# Altium project CT8042.PrjPcb (part 2 of 2)

## Sheet IBVG-DRIVER.SchDoc
size Tabloid; SheetNumber: 5; SheetTotal: 10
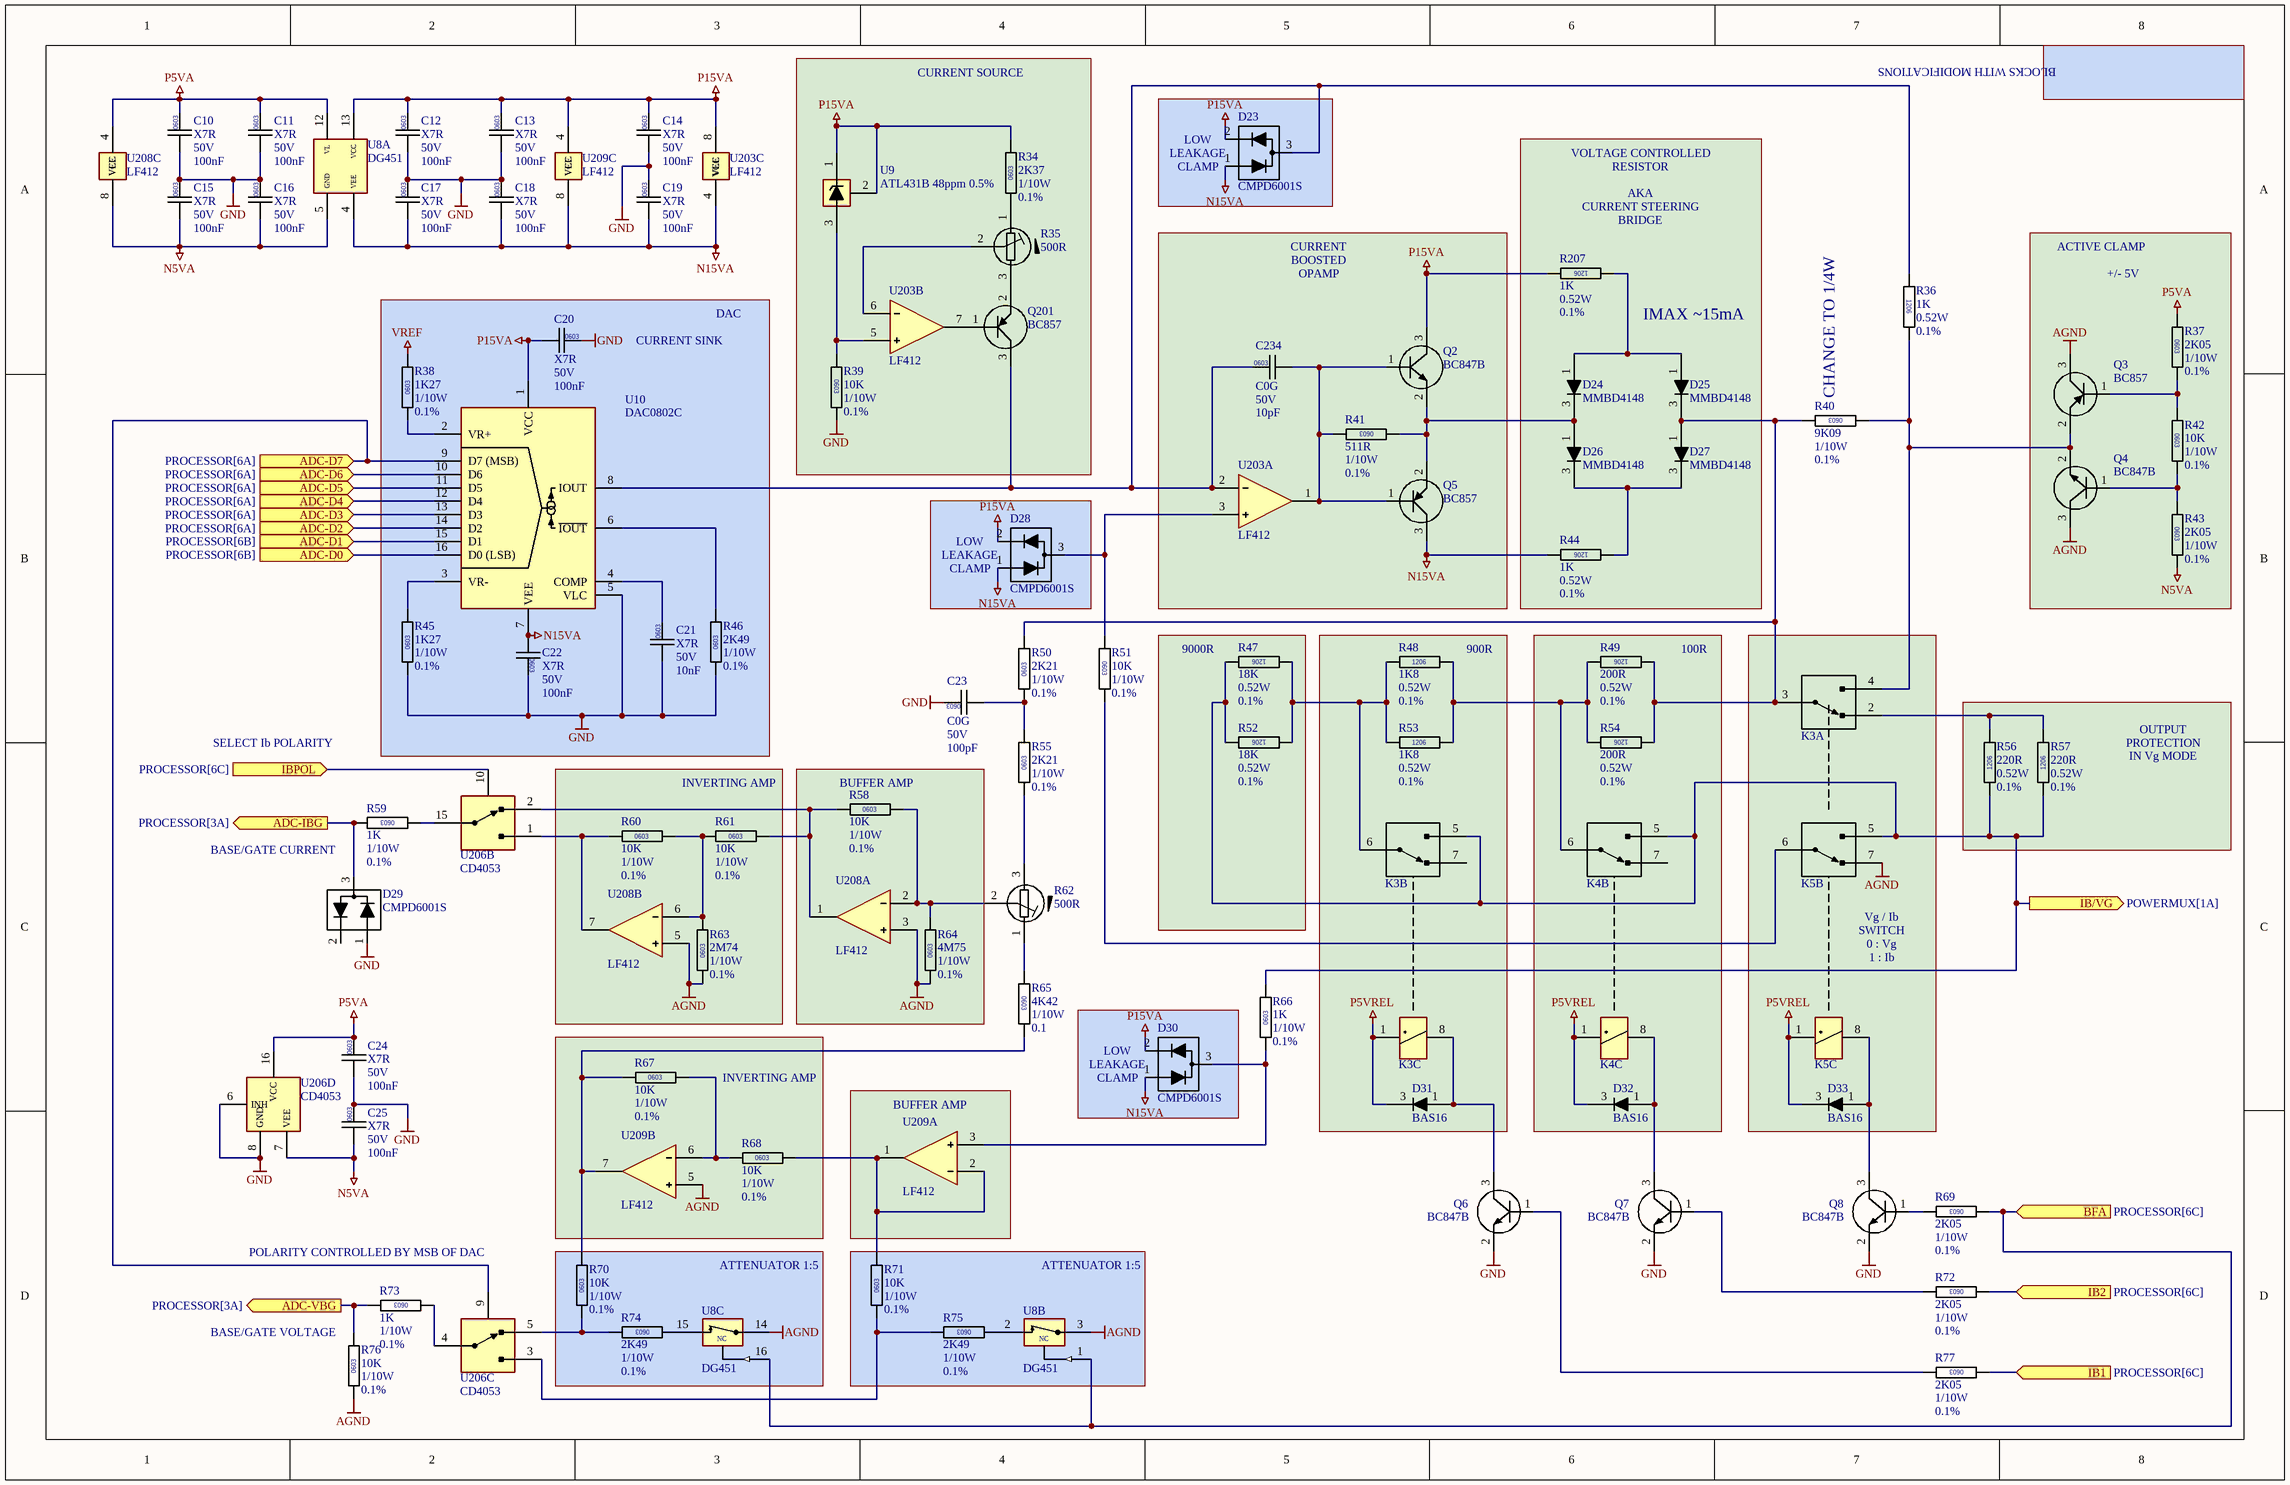
[diagram p6: IBVG-DRIVER.SchDoc]

### Parts
C10  Dielectric: X7R  Voltage: 50V  Capacitance: 100nF  [CAPC0603]  (hidden comment: CAP0603)
C11  Dielectric: X7R  Voltage: 50V  Capacitance: 100nF  [CAPC0603]  (hidden comment: CAP0603)
C12  Dielectric: X7R  Voltage: 50V  Capacitance: 100nF  [CAPC0603]  (hidden comment: CAP0603)
C13  Dielectric: X7R  Voltage: 50V  Capacitance: 100nF  [CAPC0603]  (hidden comment: CAP0603)
C14  Dielectric: X7R  Voltage: 50V  Capacitance: 100nF  [CAPC0603]  (hidden comment: CAP0603)
C15  Dielectric: X7R  Voltage: 50V  Capacitance: 100nF  [CAPC0603]  (hidden comment: CAP0603)
C16  Dielectric: X7R  Voltage: 50V  Capacitance: 100nF  [CAPC0603]  (hidden comment: CAP0603)
C17  Dielectric: X7R  Voltage: 50V  Capacitance: 100nF  [CAPC0603]  (hidden comment: CAP0603)
C18  Dielectric: X7R  Voltage: 50V  Capacitance: 100nF  [CAPC0603]  (hidden comment: CAP0603)
C19  Dielectric: X7R  Voltage: 50V  Capacitance: 100nF  [CAPC0603]  (hidden comment: CAP0603)
C20  Dielectric: X7R  Voltage: 50V  Capacitance: 100nF  [CAPC0603]  (hidden comment: CAP0603)
C21  Dielectric: X7R  Voltage: 50V  Capacitance: 10nF  [CAPC0603]  (hidden comment: CAP0603)
C22  Dielectric: X7R  Voltage: 50V  Capacitance: 100nF  [CAPC0603]  (hidden comment: CAP0603)
C23  Dielectric: C0G  Voltage: 50V  Capacitance: 100pF  [CAPC0603]  (hidden comment: CAP0603)
C24  Dielectric: X7R  Voltage: 50V  Capacitance: 100nF  [CAPC0603]  (hidden comment: CAP0603)
C25  Dielectric: X7R  Voltage: 50V  Capacitance: 100nF  [CAPC0603]  (hidden comment: CAP0603)
C234  Dielectric: C0G  Voltage: 50V  Capacitance: 10pF  [CAPC0603]  (hidden comment: CAP0603)
D23  CMPD6001S  [SOT23]
D24  MMBD4148
D25  MMBD4148
D26  MMBD4148
D27  MMBD4148
D28  CMPD6001S  [SOT23]
D29  CMPD6001S  [SOT23]
D30  CMPD6001S  [SOT23]
D31  BAS16  [SOT23]
D32  BAS16  [SOT23]
D33  BAS16  [SOT23]
K3  RELAY-KEMET-UA2-5NJ  [RELAY-KEMET-UA2-5NJ]  (value not drawn)  (parts A,B,C of 3)
K4  RELAY-KEMET-UA2-5NJ  [RELAY-KEMET-UA2-5NJ]  (value not drawn)  (parts B,C of 3)
K5  RELAY-KEMET-UA2-5NJ  [RELAY-KEMET-UA2-5NJ]  (value not drawn)  (parts B,C of 3)
Q2  BC847B  [SOT23]
Q3  BC857  [SOT23]
Q4  BC847B  [SOT23]
Q5  BC857  [SOT23]
Q6  BC847B  [SOT23]
Q7  BC847B  [SOT23]
Q8  BC847B  [SOT23]
Q201  BC857  [SOT23]
R34  value 2K37  Power: 1/10W  Tolerance: 0.1%  [RESC0603]  (hidden comment: RESC0603)
R35  value 500R  [TRIMMER-BOURNS-3214X]  (hidden comment: TRIMMER-BOURNS-3214X-1-501)
R36  value 1K  Power: 0.52W  Tolerance: 0.1%  [RESC1206]  (hidden comment: RESC1206)
R37  value 2K05  Power: 1/10W  Tolerance: 0.1%  [RESC0603]  (hidden comment: RESC0603)
R38  value 1K27  Power: 1/10W  Tolerance: 0.1%  [RESC0603]  (hidden comment: RESC0603)
R39  value 10K  Power: 1/10W  Tolerance: 0.1%  [RESC0603]  (hidden comment: RESC0603)
R40  value 9K09  Power: 1/10W  Tolerance: 0.1%  [RESC0603]  (hidden comment: RESC0603)
R41  value 511R  Power: 1/10W  Tolerance: 0.1%  [RESC0603]  (hidden comment: RESC0603)
R42  value 10K  Power: 1/10W  Tolerance: 0.1%  [RESC0603]  (hidden comment: RESC0603)
R43  value 2K05  Power: 1/10W  Tolerance: 0.1%  [RESC0603]  (hidden comment: RESC0603)
R44  value 1K  Power: 0.52W  Tolerance: 0.1%  [RESC1206]  (hidden comment: RESC1206)
R45  value 1K27  Power: 1/10W  Tolerance: 0.1%  [RESC0603]  (hidden comment: RESC0603)
R46  value 2K49  Power: 1/10W  Tolerance: 0.1%  [RESC0603]  (hidden comment: RESC0603)
R47  value 18K  Power: 0.52W  Tolerance: 0.1%  [RESC1206]  (hidden comment: RESC1206)
R48  value 1K8  Power: 0.52W  Tolerance: 0.1%  [RESC1206]  (hidden comment: RESC1206)
R49  value 200R  Power: 0.52W  Tolerance: 0.1%  [RESC1206]  (hidden comment: RESC1206)
R50  value 2K21  Power: 1/10W  Tolerance: 0.1%  [RESC0603]  (hidden comment: RESC0603)
R51  value 10K  Power: 1/10W  Tolerance: 0.1%  [RESC0603]  (hidden comment: RESC0603)
R52  value 18K  Power: 0.52W  Tolerance: 0.1%  [RESC1206]  (hidden comment: RESC1206)
R53  value 1K8  Power: 0.52W  Tolerance: 0.1%  [RESC1206]  (hidden comment: RESC1206)
R54  value 200R  Power: 0.52W  Tolerance: 0.1%  [RESC1206]  (hidden comment: RESC1206)
R55  value 2K21  Power: 1/10W  Tolerance: 0.1%  [RESC0603]  (hidden comment: RESC0603)
R56  value 220R  Power: 0.52W  Tolerance: 0.1%  [RESC1206]  (hidden comment: RESC1206)
R57  value 220R  Power: 0.52W  Tolerance: 0.1%  [RESC1206]  (hidden comment: RESC1206)
R58  value 10K  Power: 1/10W  Tolerance: 0.1%  [RESC0603]  (hidden comment: RESC0603)
R59  value 1K  Power: 1/10W  Tolerance: 0.1%  [RESC0603]  (hidden comment: RESC0603)
R60  value 10K  Power: 1/10W  Tolerance: 0.1%  [RESC0603]  (hidden comment: RESC0603)
R61  value 10K  Power: 1/10W  Tolerance: 0.1%  [RESC0603]  (hidden comment: RESC0603)
R62  value 500R  [TRIMMER-BOURNS-3214X]  (hidden comment: TRIMMER-BOURNS-3214X-1-501)
R63  value 2M74  Power: 1/10W  Tolerance: 0.1%  [RESC0603]  (hidden comment: RESC0603)
R64  value 4M75  Power: 1/10W  Tolerance: 0.1%  [RESC0603]  (hidden comment: RESC0603)
R65  value 4K42  Power: 1/10W  Tolerance: 0.1  [RESC0603]  (hidden comment: RESC0603)
R66  value 1K  Power: 1/10W  Tolerance: 0.1%  [RESC0603]  (hidden comment: RESC0603)
R67  value 10K  Power: 1/10W  Tolerance: 0.1%  [RESC0603]  (hidden comment: RESC0603)
R68  value 10K  Power: 1/10W  Tolerance: 0.1%  [RESC0603]  (hidden comment: RESC0603)
R69  value 2K05  Power: 1/10W  Tolerance: 0.1%  [RESC0603]  (hidden comment: RESC0603)
R70  value 10K  Power: 1/10W  Tolerance: 0.1%  [RESC0603]  (hidden comment: RESC0603)
R71  value 10K  Power: 1/10W  Tolerance: 0.1%  [RESC0603]  (hidden comment: RESC0603)
R72  value 2K05  Power: 1/10W  Tolerance: 0.1%  [RESC0603]  (hidden comment: RESC0603)
R73  value 1K  Power: 1/10W  Tolerance: 0.1%  [RESC0603]  (hidden comment: RESC0603)
R74  value 2K49  Power: 1/10W  Tolerance: 0.1%  [RESC0603]  (hidden comment: RESC0603)
R75  value 2K49  Power: 1/10W  Tolerance: 0.1%  [RESC0603]  (hidden comment: RESC0603)
R76  value 10K  Power: 1/10W  Tolerance: 0.1%  [RESC0603]  (hidden comment: RESC0603)
R77  value 2K05  Power: 1/10W  Tolerance: 0.1%  [RESC0603]  (hidden comment: RESC0603)
R207  value 1K  Power: 0.52W  Tolerance: 0.1%  [RESC1206]  (hidden comment: RESC1206)
U8  DG451  [SO127P600-16N]  (parts A,B,C of 5)
U9  ATL431B 48ppm 0.5%  [SOT23]
U10  DAC0802C
U203  LF412  [SO127P600-8N]  (parts A,B,C of 3)
U206  CD4053  [SO127P600-16N]  (parts B,C,D of 4)
U208  LF412  [SO127P600-8N]  (parts A,B,C of 3)
U209  LF412  [SO127P600-8N]  (parts A,B,C of 3)

### Blocks framed on the sheet
CURRENT SOURCE: Q201 R34 R35 R39 U9 U203
IMAX ~15mA: D24-D27 R44 R207
9000R: R47 R52
900R: D31 K3 R48 R53
100R: D32 K4 R49 R54
INVERTING AMP: R60 R61 R63 U208
BUFFER AMP: R58 R64 U208
INVERTING AMP: R67 R68 U209
BUFFER AMP: U209
ATTENUATOR 1:5: R70 R74 U8
ATTENUATOR 1:5: R71 R75 U8

### Ports
ADC-D0 (in, see PROCESSOR[6B]), ADC-D1 (in, see PROCESSOR[6B]), ADC-D2 (in, see PROCESSOR[6A]), ADC-D3 (in, see PROCESSOR[6A]), ADC-D4 (in, see PROCESSOR[6A]), ADC-D5 (in, see PROCESSOR[6A]), ADC-D6 (in, see PROCESSOR[6A]), ADC-D7 (in, see PROCESSOR[6A]), ADC-IBG (out, see PROCESSOR[3A]), ADC-VBG (out, see PROCESSOR[3A]), BFA (in, see PROCESSOR[6C]), IB1 (in, see PROCESSOR[6C]), IB2 (in, see PROCESSOR[6C]), IB/VG (out, see POWERMUX[1A]), IBPOL (in, see PROCESSOR[6C])

### Nets
AGND: K5.7(NC) Q3.3(C) Q4.3(C) R63.2 R64.2 R76.2 U8.3 U8.14 U208.3(+) U208.5(+) U209.5(+)
GND: C10.2 C11.2 C12.2 C13.2 C14.2 C15.1 C16.1 C17.1 C18.1 C19.1 C20.1 C21.2 C22.1 C23.1 C24.2 C25.1 D29.1(K) Q6.2(E) Q7.2(E) Q8.2(E) R39.1 R45.2 R46.2 U10.5(VLC) U206.6(INH) U206.8(GND)
N5VA: C15.2 C16.2 C25.2 R43.2 U8.5(GND) U206.7(VEE) U208.8(VCC)
N15VA: C17.2 C18.2 C19.2 C22.2 D23.1(K) D28.1(K) D30.1(K) Q5.3(C) R44.1 U8.4(VEE) U10.7(VEE) U203.4(VEE) U209.8(VCC)
P5VA: C10.1 C11.1 C24.1 R37.1 U8.12(VL) U206.16(VCC) U208.4(VEE)
P5VREL: D31.3(K) D32.3(K) D33.3(K) K3.1 K4.1 K5.1
P15VA: C12.1 C13.1 C14.1 C20.2 D23.2(A) D28.2(A) D30.2(A) Q2.3(C) R34.1 R207.1 U8.13(VCC) U9.1 U9.2 U10.1(VCC) U203.8(VCC) U209.4(VEE)
VREF: R38.1
ADC-D0: U10.16(D0_(LSB)) ; port ADC-D0
ADC-D1: U10.15(D1) ; port ADC-D1
ADC-D2: U10.14(D2) ; port ADC-D2
ADC-D3: U10.13(D3) ; port ADC-D3
ADC-D4: U10.12(D4) ; port ADC-D4
ADC-D5: U10.11(D5) ; port ADC-D5
ADC-D6: U10.10(D6) ; port ADC-D6
ADC-D7: U10.9(D7_(MSB)) U206.9(B) ; port ADC-D7
ADC-IBG: D29.3(A) R59.1 ; port ADC-IBG
ADC-VBG: R73.1 R76.1 ; port ADC-VBG
BFA: R69.1 U8.1 U8.16 ; port BFA
IB1: R77.1 ; port IB1
IB2: R72.1 ; port IB2
IB/VG: K3.5(NO) K4.5(NO) K5.5(NO) R47.2 R52.2 R56.2 R57.2 R66.1 ; port IB/VG
IBPOL: U206.10(A) ; port IBPOL
NetC21_1: C21.1 U10.4(COMP)
NetC23_2: C23.2 R50.2 R55.1
NetC234_1: C234.1 D23.3(A) Q201.3(C) R36.2 U10.8(IOUT) U203.2(-)
NetC234_2: C234.2 Q2.1(B) Q5.1(B) R41.1 U203.1(O)
NetD24_1: D24.1(A) D25.1(A) R207.2
NetD24_3: D24.3(K) D26.1(A) Q2.2(E) Q5.2(E) R41.2
NetD25_3: D25.3(K) D27.1(A) K3.3(COM) R40.1 R49.1 R50.1 R54.1
NetD26_3: D26.3(K) D27.3(K) R44.2
NetD28_3: D28.3(A) R51.2 U203.3(+)
NetD30_3: D30.3(A) R66.2 U209.3(+)
NetD31_1: D31.1(A) K3.8 Q6.3(C)
NetD32_1: D32.1(A) K4.8 Q7.3(C)
NetD33_1: D33.1(A) K5.8 Q8.3(C)
NetK3_2: K3.2(NC) R56.1 R57.1
NetK3_4: K3.4(NO) Q3.2(E) Q4.2(E) R36.1 R40.2
NetK3_6: K3.6(COM) R47.1 R48.1 R52.1 R53.1
NetK4_6: K4.6(COM) R48.2 R49.2 R53.2 R54.2
NetK5_6: K5.6(COM) R51.1
NetQ3_1: Q3.1(B) R37.2 R42.2
NetQ4_1: Q4.1(B) R42.1 R43.1
NetQ6_1: Q6.1(B) R77.2
NetQ7_1: Q7.1(B) R72.2
NetQ8_1: Q8.1(B) R69.2
NetQ201_1: Q201.1(B) U203.7(O)
NetQ201_2: Q201.2(E) R35.3
NetR34_2: R34.2 R35.1
NetR35_2: R35.2 U203.6(-)
NetR38_2: R38.2 U10.2(VR+)
NetR39_2: R39.2 U9.3 U203.5(+)
NetR45_1: R45.1 U10.3(VR-)
NetR46_1: R46.1 U10.6(~{IOUT})
NetR55_2: R55.2 R62.3
NetR58_1: R58.1 R62.2 R64.1 U208.2(-)
NetR58_2: R58.2 R61.1 U206.2(Y2) U208.1(O)
NetR59_2: R59.2 U206.15(X2)
NetR60_1: R60.1 R61.2 R63.1 U208.6(-)
NetR60_2: R60.2 U206.1(Y0) U208.7(O)
NetR62_1: R62.1 R65.2
NetR65_1: R65.1 R67.2 R70.1 U209.7(O)
NetR67_1: R67.1 R68.2 U209.6(-)
NetR68_1: R68.1 R71.1 U209.1(O) U209.2(-)
NetR70_2: R70.2 R74.1 U206.5(Y1)
NetR71_2: R71.2 R75.1 U206.3(Y)
NetR73_2: R73.2 U206.4(Y3)
NetR74_2: R74.2 U8.15
NetR75_2: R75.2 U8.2

Not connected (* = marked no-connect by the designer): D29 2(A); K3 7(NC); K4 7(NC)

### Notes on the sheet
- BLOCKS WITH MODIFICATIONS
- (near D23) LOW
- (near D23) LEAKAGE
- (near D23) CLAMP
- VOLTAGE CONTROLLED
- RESISTOR
- AKA
- CURRENT STEERING
- (near R207) BRIDGE
- CURRENT
- BOOSTED
- OPAMP
- ACTIVE CLAMP
- +/- 5V
- CURRENT SINK
- DAC
- (near R40) CHANGE TO 1/4W
- (near D28) LOW
- (near D28) LEAKAGE
- (near D28) CLAMP
- SELECT Ib POLARITY
- PROTECTION
- IN Vg MODE
- OUTPUT
- BASE/GATE CURRENT
- SWITCH
- 0 : Vg
- (near K5) Vg / Ib
- 1 : Ib
- (near D30) LOW
- (near D30) LEAKAGE
- (near D30) CLAMP
- POLARITY CONTROLLED BY MSB OF DAC
- (near R76) BASE/GATE VOLTAGE
- (in symbol IC-SILICONIX-DG451, part B) NC
- (in symbol IC-SILICONIX-DG451, part C) NC
- (in symbol RESC-0603-1K27-0.1%-1/10W) 0603
- (in symbol RESC-0603-1K-0.1%-1/10W) 0603
- (in symbol RESC-0603-2K05-0.1%-1/10W) 0603
- (in symbol RESC-0603-2K21-0.1%-1/10W) 0603
- (in symbol RESC-0603-2K37-0.1%-1/10W) 0603
- (in symbol RESC-0603-2K49-0.1%-1/10W) 0603
- (in symbol RESC-0603-2M74-0.1%-1/10W) 0603
- (in symbol RESC-0603-4K42-0.1%-1/10W) 0603
- (in symbol RESC-0603-4M75-1%-1/10W) 0603
- (in symbol RESC-0603-9K09-0.1%-1/10W) 0603
- (in symbol RESC-0603-10K-0.1%-1/10W) 0603
- (in symbol RESC-0603-511R-0.1%-1/10W) 0603
- (in symbol RESC-1206-1K8-0.1%-1/2W) 1206
- (in symbol RESC-1206-1K-0.1%-1/2W) 1206
- (in symbol RESC-1206-18K-0.1%-1/2W) 1206
- (in symbol RESC-1206-200R-0.1%-1/2W) 1206
- (in symbol RESC-1206-220R-0.1%-1/2W) 1206

### Library data of the parts
C10-C20 C22 C24 C25 = CAPC-0603-100nF-50V-X7R: CAPACITOR,CERAMIC,100nF,50V,X7R,0603; Manufacturer 1: KEMET; Manufacturer Part Number 1: C0603C104K5RACTU; Package / Case: 0603; Location: *; Supplier 1: Mouser; Supplier Part Number 1: 80-C0603C104K5R7867; Supplier 2: Mouser; Supplier Part Number 2: 80-C0603C104K5R7411; Supplier 3: Avnet; Supplier Part Number 3: KGM15BR71H104KT; Supplier 4: Digikey; Supplier Part Number 4: 1276-1000-1-ND; LCSC: C127833; MOUSER: 80-C0603C104K5R
C21 = CAPC-0603-10nF-50V-X7R: CAPACITOR,CERAMIC,10nF,50V,X7R,0603; Package / Case: 0603; Location: *
C23 = CAPC-0603-100pF-50V-C0G: CAPACITOR,CERAMIC,100pF,50V,C0G,0603; Package / Case: 0603; Location: *
C234 = CAPC-0603-10PF-50V-C0G: CAPACITOR,CERAMIC,10pF,50V,C0G,0603; Manufacturer 1: KYOCERA; Manufacturer Part Number 1: C0603C100J5GAC; Package / Case: 0603; Location: *; MOUSER: 80-C0603C100J5GAC
D23 D28-D30 = DIODE-CENTRALSEMI-CMPD6001S: DIODE,75V,250mA,SOT23,500pA ULTRA LOW LEAKAGE; Manufacturer 1: CENTRAL SEMICONDUCTOR; Manufacturer Part Number 1: CMPD6001S
D24-D27 = DIODE-RECTIFIER-DIODES-MMBD4148-SOT23: DIODE,RECTIFIER,75V,0.3A,MMBD4148,SOT23; Manufacturer 1: DIODES; Manufacturer Part Number 1: MMBD4148
D31-D33 = DIODE-RECTIFIER-DIODES-BAS16-SOT23: DIODE,RECTIFIER,75V,0.3A,BAS16,SOT23; Manufacturer 1: ONSEMI; Manufacturer Part Number 1: BAS16LT1G
K3-K5 = RELAY-KEMET-UA2-5NJ: RELAY,DPDT,1A,250VAC,220VDC,5V COIL,KEMET,UA2-5NJ; DIGIKEY: 399-UA2-5NJ-ND; Manufacturer 1: KEMET; Manufacturer Part Number 1: UA2-5NJ
Q2 Q4 Q6-Q8 = XSTR-NPN-BC847: XSTR,NPN,45V,0.1A,,BC847B,SOT23
Q3 Q5 Q201 = XSTR-PNP-BC857: XSTR,PNP,SOT23,BC857,SOT23; Manufacturer 1: NEXPERIA; Manufacturer Part Number 1: BC857BW,115; DIGIKEY: 1727-4869-1-ND
R34 = RESC-0603-2K37-0.1%-1/10W: RESISTOR,2K37,0.1%,100mW,0603 (1608); Location: *
R35 R62 = TRIMMER-BOURNS-3214X-1-501: RESISTOR,MULTITURN,VERTICAL,5T,500R; Manufacturer 1: BOURNS; Manufacturer Part Number 1: 3214X-1-501E
R36 R44 R207 = RESC-1206-1K-0.1%-1/2W: RESISTOR,1K,1206,0.1%,520mW,1206; Manufacturer 1: VISHAY; Manufacturer Part Number 1: TNPW12061K00BEEA; Location: *; Parameter 4: *
R37 R43 R69 R72 R77 = RESC-0603-2K05-0.1%-1/10W: RESISTOR,2K05,0.11%,100mW,0603 (1608); Location: *
R38 R45 = RESC-0603-1K27-0.1%-1/10W: RESISTOR,1K27,0.1%,100mW,0603 (1608); Location: *
R39 R42 R51 R58 R60 R61 R67 R68 R70 R71 R76 = RESC-0603-10K-0.1%-1/10W: RESISTOR,10K,0.1%,100mW,0603 (1608); Manufacturer 1: PANASONIC; Manufacturer Part Number 1: ERA-3AEB103V; Location: *; DIGIKEY: P10KDBCT-ND
R40 = RESC-0603-9K09-0.1%-1/10W: RESISTOR,9K09,0.1%,100mW,0603 (1608); Location: *
R41 = RESC-0603-511R-0.1%-1/10W: RESISTOR,511R,0.1%,100mW,0603 (1608); Location: *
R46 R74 R75 = RESC-0603-2K49-0.1%-1/10W: RESISTOR,2K49,0.1%,100mW,0603 (1608); Location: *
R47 R52 = RESC-1206-18K-0.1%-1/2W: RESISTOR,18K,1206,0.1%,520mW,1206; Manufacturer 1: VISHAY; Manufacturer Part Number 1: TNPW1206220RBEEA; Location: *; Parameter 4: *
R48 R53 = RESC-1206-1K8-0.1%-1/2W: RESISTOR,1K8,1206,0.1%,520mW,1206; Manufacturer 1: VISHAY; Manufacturer Part Number 1: TNPW12061K80BEEA; Location: *; Parameter 4: *
R49 R54 = RESC-1206-200R-0.1%-1/2W: RESISTOR,200R,1206,0.1%,520mW,1206; Manufacturer 1: VISHAY; Manufacturer Part Number 1: TNPW1206200RBEEA; Location: *; Parameter 4: *
R50 R55 = RESC-0603-2K21-0.1%-1/10W: RESISTOR,2K21,0.1%,100mW,0603 (1608); Location: *
R56 R57 = RESC-1206-220R-0.1%-1/2W: RESISTOR,220R,1206,0.1%,520mW,1206; Manufacturer 1: VISHAY; Manufacturer Part Number 1: TNPW1206220RBEEA; Location: *; Parameter 4: *
R59 R66 R73 = RESC-0603-1K-0.1%-1/10W: RESISTOR,1K,0.1%,100mW,0603 (1608); Location: *
R63 = RESC-0603-2M74-0.1%-1/10W: RESISTOR,2M74,0.1%,100mW,0603 (1608); Location: *
R64 = RESC-0603-4M75-1%-1/10W: RESISTOR,4M75,0.1%,100mW,0603 (1608); Location: *
R65 = RESC-0603-4K42-0.1%-1/10W: RESISTOR,4K42,0.1%,100mW,0603 (1608); Location: *
U8 = IC-SILICONIX-DG451: IC,ANALOG,4XSPST ANALOG SWITCH,NC,,SILICONIX,DG451,SO16; Manufacturer 1: VISHAY SILICONIX; Manufacturer Part Number 1: DG451EY-T1-E3; DIGIKEY: DG451EY-T1-E3CT-ND
U9 = IC-TI-ATL431B-SOT23: IC,REGULATOR,REFERENCE,SHUNT,0.5%,48ppm,TL431,SOT23; Manufacturer 1: TI; Manufacturer Part Number 1: ATL431BIDBZR; DIGIKEY: 296-47739-1-ND
U10 = IC-TI-DAC0802LCMX/NOPB: IC,DAC,8 BIT,CURRENT DIFF,TI,DAC0802LCMX/NOPB,SO16; DIGIKEY: DAC0802LCMX/NOPBCT-ND; Manufacturer 1: TI; Manufacturer Part Number 1: DAC0802LCMX/NOPB
U203 U208 U209 = IC-TI-LF412-S08: IC,OPAMP JFET,DUAL,LF412,SO8
U206 = IC-TI-CD4053-SPLIT: IC,LOGIC,CMOS,4XXX,TRIPLE 2:1 MUX,SPLIT BLOCKS

## Sheet SWEEP.SchDoc
size Tabloid; SheetNumber: 4; SheetTotal: 9
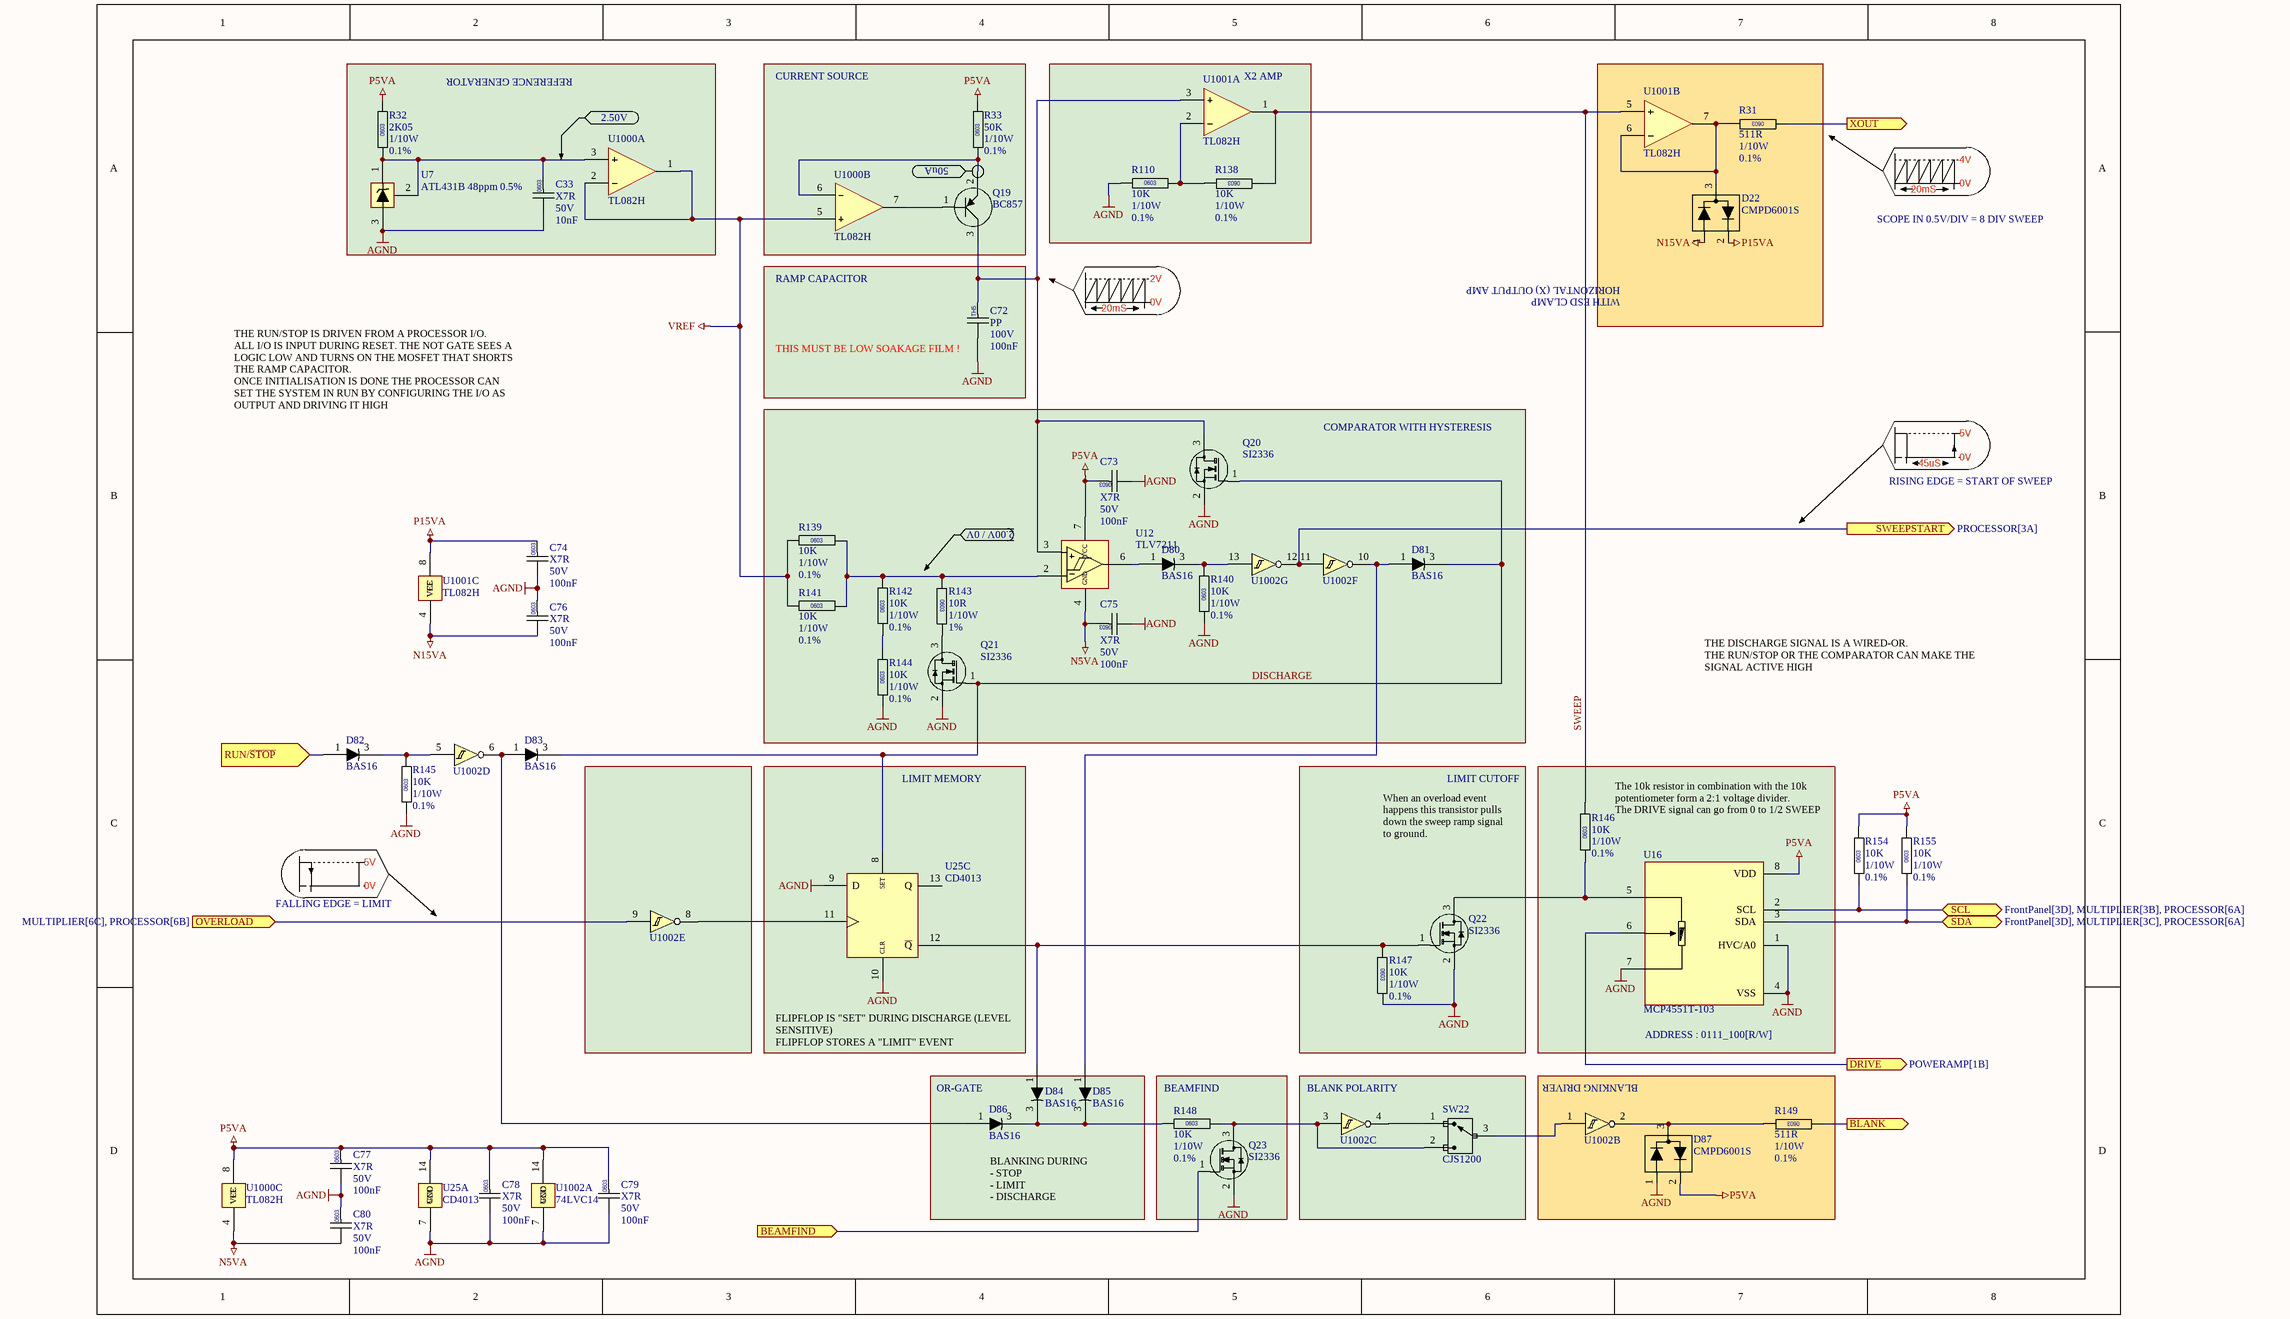
[diagram p7: SWEEP.SchDoc]

### Parts
C33  Dielectric: X7R  Voltage: 50V  Capacitance: 10nF  [CAPC0603]  (hidden comment: CAP0603)
C72  Dielectric: PP  Voltage: 100V  Capacitance: 100nF  [CAPF50P720X720]  (hidden comment: CAPF)
C73  Dielectric: X7R  Voltage: 50V  Capacitance: 100nF  [CAPC0603]  (hidden comment: CAP0603)
C74  Dielectric: X7R  Voltage: 50V  Capacitance: 100nF  [CAPC0603]  (hidden comment: CAP0603)
C75  Dielectric: X7R  Voltage: 50V  Capacitance: 100nF  [CAPC0603]  (hidden comment: CAP0603)
C76  Dielectric: X7R  Voltage: 50V  Capacitance: 100nF  [CAPC0603]  (hidden comment: CAP0603)
C77  Dielectric: X7R  Voltage: 50V  Capacitance: 100nF  [CAPC0603]  (hidden comment: CAP0603)
C78  Dielectric: X7R  Voltage: 50V  Capacitance: 100nF  [CAPC0603]  (hidden comment: CAP0603)
C79  Dielectric: X7R  Voltage: 50V  Capacitance: 100nF  [CAPC0603]  (hidden comment: CAP0603)
C80  Dielectric: X7R  Voltage: 50V  Capacitance: 100nF  [CAPC0603]  (hidden comment: CAP0603)
D22  CMPD6001S  [SOT23]
D80  BAS16  [SOT23]
D81  BAS16  [SOT23]
D82  BAS16  [SOT23]
D83  BAS16  [SOT23]
D84  BAS16  [SOT23]
D85  BAS16  [SOT23]
D86  BAS16  [SOT23]
D87  CMPD6001S  [SOT23]
Q19  BC857  [SOT23]
Q20  SI2336  [SOT23]
Q21  SI2336  [SOT23]
Q22  SI2336  [SOT23]
Q23  SI2336  [SOT23]
R31  value 511R  Power: 1/10W  Tolerance: 0.1%  [RESC0603]  (hidden comment: RESC0603)
R32  value 2K05  Power: 1/10W  Tolerance: 0.1%  [RESC0603]  (hidden comment: RESC0603)
R33  value 50K  Power: 1/10W  Tolerance: 0.1%  [RESC0603]  (hidden comment: RESC0603)
R110  value 10K  Power: 1/10W  Tolerance: 0.1%  [RESC0603]  (hidden comment: RESC0603)
R138  value 10K  Power: 1/10W  Tolerance: 0.1%  [RESC0603]  (hidden comment: RESC0603)
R139  value 10K  Power: 1/10W  Tolerance: 0.1%  [RESC0603]  (hidden comment: RESC0603)
R140  value 10K  Power: 1/10W  Tolerance: 0.1%  [RESC0603]  (hidden comment: RESC0603)
R141  value 10K  Power: 1/10W  Tolerance: 0.1%  [RESC0603]  (hidden comment: RESC0603)
R142  value 10K  Power: 1/10W  Tolerance: 0.1%  [RESC0603]  (hidden comment: RESC0603)
R143  value 10R  Power: 1/10W  Tolerance: 1%  [RESC0603]  (hidden comment: RESC0603)
R144  value 10K  Power: 1/10W  Tolerance: 0.1%  [RESC0603]  (hidden comment: RESC0603)
R145  value 10K  Power: 1/10W  Tolerance: 0.1%  [RESC0603]  (hidden comment: RESC0603)
R146  value 10K  Power: 1/10W  Tolerance: 0.1%  [RESC0603]  (hidden comment: RESC0603)
R147  value 10K  Power: 1/10W  Tolerance: 0.1%  [RESC0603]  (hidden comment: RESC0603)
R148  value 10K  Power: 1/10W  Tolerance: 0.1%  [RESC0603]  (hidden comment: RESC0603)
R149  value 511R  Power: 1/10W  Tolerance: 0.1%  [RESC0603]  (hidden comment: RESC0603)
R154  value 10K  Power: 1/10W  Tolerance: 0.1%  [RESC0603]  (hidden comment: RESC0603)
R155  value 10K  Power: 1/10W  Tolerance: 0.1%  [RESC0603]  (hidden comment: RESC0603)
SW22  CJS1200  [SWITCH-NIDEC-CJS-1200TB1]
U7  ATL431B 48ppm 0.5%  [SOT23]
U12  TLV7211  [SO127P600-8N]
U16  MCP4551T-103  [SO65P490-8N]
U25  CD4013  [SO127P600-14N]  (parts A,C of 3)
U1000  TL082H  [SO127P600-8N]  (parts A,B,C of 3)
U1001  TL082H  [SO127P600-8N]  (parts A,B,C of 3)
U1002  74LVC14  [SO127P600-14N]  (parts A,B,C,D,E,F,G of 7)

### Blocks framed on the sheet
X2 AMP: R110 R138 U1001
LIMIT MEMORY: U25
LIMIT CUTOFF: Q22 R147
ADDRESS : 0111_100[R/W]: R146 U16
OR-GATE: D84-D86
BEAMFIND: Q23 R148
BLANK POLARITY: SW22 U1002
BLANKING DRIVER: D87 R149 U1002

### Ports
BEAMFIND (in), BLANK (out), DRIVE (out, see POWERAMP[1B]), OVERLOAD (in, see MULTIPLIER[6C], PROCESSOR[6B]), RUN/~{STOP} (in), SCL (bidir, see FrontPanel[3D], MULTIPLIER[3B], PROCESSOR[6A]), SDA (bidir, see FrontPanel[3D], MULTIPLIER[3C], PROCESSOR[6A]), SWEEPSTART (out, see PROCESSOR[3A]), XOUT (out)

### Nets
AGND: C33.2 C72.2 C73.2 C74.2 C75.2 C76.1 C77.2 C78.2 C79.2 C80.1 D87.1(K) Q20.2(S) Q21.2(S) Q22.2(S) Q23.2(S) R110.2 R140.2 R144.2 R145.2 R147.1 U7.3 U16.1(HVC/A0) U16.4(VSS) U16.7(POB) U25.7(GND) U25.9(D) U25.10(CLR) U1002.7(GND)
N5VA: C75.1 C80.2 U12.4(GND) U1000.4(VEE)
N15VA: C76.2 D22.1(K) U1001.4(VEE)
P5VA: C73.1 C77.1 C78.1 C79.1 D87.2(A) R32.1 R33.1 R154.1 R155.1 U12.7(VCC) U16.8(VDD) U25.14(VCC) U1000.8(VCC) U1002.14(VCC)
P15VA: C74.1 D22.2(A) U1001.8(VCC)
VREF: R139.2 R141.2 U1000.1(O) U1000.2(-) U1000.5(+)
BEAMFIND: Q23.1(G1) ; port BEAMFIND
BLANK: R149.2 ; port BLANK
DISCHARGE: D81.3(K) D83.3(K) Q20.1(G1) Q21.1(G1) U25.8(SET)
DRIVE: U16.6(OW) ; port DRIVE
OVERLOAD: U1002.9 ; port OVERLOAD
RUN/~{STOP}: D82.1(A) ; port RUN/~{STOP}
SCL: R154.2 U16.2(SCL) ; port SCL
SDA: R155.2 U16.3(SDA) ; port SDA
SWEEP: R138.2 R146.1 U1001.1(O) U1001.5(+)
SWEEPSTART: U1002.11 U1002.12 ; port SWEEPSTART
XOUT: R31.2 ; port XOUT
NetC33_1: C33.1 R32.2 U7.1 U7.2 U1000.3(+)
NetC72_1: C72.1 Q19.3(C) Q20.3(D) U12.3(+) U1001.3(+)
NetD22_3: D22.3(A) R31.1 U1001.6(-) U1001.7(O)
NetD80_1: D80.1(A) U12.6(OUT)
NetD80_3: D80.3(K) R140.1 U1002.13
NetD81_1: D81.1(A) D85.1(A) U1002.10
NetD82_3: D82.3(K) R145.1 U1002.5
NetD83_1: D83.1(A) D86.1(A) U1002.6
NetD84_1: D84.1(A) Q22.1(G1) R147.2 U25.12(~{Q})
NetD84_3: D84.3(K) D85.3(K) D86.3(K) R148.2
NetD87_3: D87.3(A) R149.1 U1002.2
NetQ19_1: Q19.1(B) U1000.7(O)
NetQ19_2: Q19.2(E) R33.2 U1000.6(-)
NetQ21_3: Q21.3(D) R143.1
NetQ22_3: Q22.3(D) R146.2 U16.5(POA)
NetQ23_3: Q23.3(D) R148.1 SW22.2 U1002.3
NetR110_1: R110.1 R138.1 U1001.2(-)
NetR139_1: R139.1 R141.1 R142.1 R143.2 U12.2(-)
NetR142_2: R142.2 R144.1
NetSW22_1: SW22.1 U1002.4
NetSW22_3: SW22.3 U1002.1
NetU25_11: U25.11(CLK) U1002.8

Not connected (* = marked no-connect by the designer): U25 13(Q)

### Notes on the sheet
- REFERENCE GENERATOR
- CURRENT SOURCE
- (near U1000) 2.50V
- (near Q19) 50uA
- 20mS
- 4V
- 0V
- SCOPE IN 0.5V/DIV = 8 DIV SWEEP
- RAMP CAPACITOR
- 2V
- HORIZONTAL (X) OUTPUT AMP
- WITH ESD CLAMP
- (near C72) THIS MUST BE LOW SOAKAGE FILM !
- THE RUN/STOP IS DRIVEN FROM A PROCESSOR I/O.
  ALL I/O IS INPUT DURING RESET. THE NOT GATE SEES A LOGIC LOW AND TURNS ON THE MOSFET THAT SHORTS THE RAMP CAPACITOR.
  ONCE INITIALISATION IS DONE THE PROCESSOR CAN SET THE SYSTEM IN RUN BY CONFIGURING THE I/O AS OUTPUT AND DRIVING IT HIGH
- COMPARATOR WITH HYSTERESIS
- 5V
- RISING EDGE = START OF SWEEP
- 45uS
- 2.00V / 0V
- THE DISCHARGE SIGNAL IS A WIRED-OR.
  THE RUN/STOP OR THE COMPARATOR CAN MAKE THE SIGNAL ACTIVE HIGH
- (near U16) The 10k resistor in combination with the 10k potentiometer form a 2:1 voltage divider.
  The DRIVE signal can go from 0 to 1/2 SWEEP
- FALLING EDGE = LIMIT
- When an overload event happens this transistor pulls down the sweep ramp signal to ground.
- FLIPFLOP IS "SET" DURING DISCHARGE (LEVEL SENSITIVE)
  FLIPFLOP STORES A "LIMIT" EVENT
- (near D86) BLANKING DURING
  - STOP
  - LIMIT
  - DISCHARGE
- (in symbol CAPF-100nF-100V) TH5
- (in symbol RESC-0603-2K05-0.1%-1/10W) 0603
- (in symbol RESC-0603-10K-0.1%-1/10W) 0603
- (in symbol RESC-0603-10R-1%-1/10W) 0603
- (in symbol RESC-0603-50K-0.1%-1/10W) 0603
- (in symbol RESC-0603-511R-0.1%) 0603

### Library data of the parts
C33 = CAPC-0603-10nF-50V-X7R: CAPACITOR,CERAMIC,10nF,50V,X7R,0603; Package / Case: 0603; Location: *
C72 = CAPF-100nF-100V: CAPACITOR,POLYPROP,100nF,100V; Manufacturer 1: KEMET; Manufacturer Part Number 1: PHE426DJ6100JR05; Package / Case: CAPF50P720X720; Location: *; DIGIKEY: 399-11462-ND
C73-C80 = CAPC-0603-100nF-50V-X7R: as C10-C20 on sheet IBVG-DRIVER; Package / Case: 0603; Location: *; Supplier 1: Mouser; Supplier Part Number 1: 80-C0603C104K5R7867; Supplier 2: Mouser; Supplier Part Number 2: 80-C0603C104K5R7411; Supplier 3: Avnet; Supplier Part Number 3: KGM15BR71H104KT; Supplier 4: Digikey; Supplier Part Number 4: 1276-1000-1-ND; LCSC: C127833; MOUSER: 80-C0603C104K5R
D22 D87 = DIODE-CENTRALSEMI-CMPD6001S: as D23 on sheet IBVG-DRIVER; DIGIKEY: 1514-CMPD6001STRPBFREECT-ND; Manufacturer Part Number 1: CMPD6001S
D80-D86 = DIODE-RECTIFIER-DIODES-BAS16-SOT23: as D31-D33 on sheet IBVG-DRIVER; DIGIKEY: BAS16LT1GOSCT-ND
Q19 = XSTR-PNP-BC857: as Q3 on sheet IBVG-DRIVER; DIGIKEY: 1727-4869-1-ND
Q20-Q23 = XSTR-NMOS-VISHAY-SI2336DS-T1-BE3: XSTR,NMOS,30V,4.3A,SI2336DS-T1-BE3.SOT23; Manufacturer 1: VISHAY; Package: SOT23; Vds: 30V; Idmax: 4.3A; DIGIKEY: 742-SI2336DS-T1-BE3CT-ND; Manufacturer Part Number 1: SI2336DS-T1-BE3
R31 R149 = RESC-0603-511R-0.1%: RESISTOR,511R,0.1%,100mW,0603 (1608); Location: *
R32 = RESC-0603-2K05-0.1%-1/10W: RESISTOR,2K05,0.11%,100mW,0603 (1608); Location: *
R33 = RESC-0603-50K-0.1%-1/10W: RESISTOR,50K,0.1%,100mW,0603 (1608); Location: *
R110 R138-R142 R144-R148 R154 R155 = RESC-0603-10K-0.1%-1/10W: as R39 on sheet IBVG-DRIVER; Location: *; DIGIKEY: P10KDBCT-ND
R143 = RESC-0603-10R-1%-1/10W: RESISTOR,10R,1%,100mW,0603 (1608); Location: *
SW22 = SWITCH-NIDEC-CJS-1200TB1: SWITCH,SPST,SLIDE,SMD; Manufacturer 1: NIDEC; DIGIKEY: 563-CJS-1200TB1CT-ND; Manufacturer Part Number 1: CJS-1200TB1
U7 = IC-TI-ATL431B-SOT23: as U9 on sheet IBVG-DRIVER; DIGIKEY: 296-47739-1-ND
U12 = IC-TI-TLV7211-SO8: IC,COMPARATOR,SINGLE,PUSHPULL,TI,TLV7211,SO8; Manufacturer Part Number 1: TLV7211IDR; DIGIKEY: 296-21871-1-ND; Manufacturer 1: TI
U16 = IC-MICROCHIP-MCP4551T-103: IC,DIGITAL POTMETER,257STEP,I2C,10K,MICROCHIP,MCP4551T-103; Manufacturer Part Number 1: MCP4551T-103E/MS; DIGIKEY: MCP4551T-103E/MSCT-ND; Manufacturer 1: MICROCHIP
U25 = IC-TI-CD4013-SO14: IC,LOGIC,CMOS,4XXX,DUAL D-FLIPFLOP,CD4013; Manufacturer 1: TI; Manufacturer Part Number 1: CD4013BM96; DIGIKEY: 296-24347-1-ND
U1000 U1001 = IC-TI-TL082H-SO8: IC,OPAMP JFET,DUAL,TL082HIDR,SO8; Manufacturer 1: TI; Manufacturer Part Number 1: TL082HIDR; MOUSER: 595-TL082HIDR
U1002 = IC-DIODES-74LVC14AS14-13-SO14: IC,LOGIC,CMOS,74XX,HEX SCHMITTTRIGGER,74LVC14AS14-13,SO14; Manufacturer 1: DIODES; DIGIKEY: 74LVC14AS14-13DICT-ND; Manufacturer Part Number 1: 74LVC14AS14-13

## Sheet MULTIPLIER.SchDoc
size Tabloid; SheetNumber: 7; SheetTotal: 9
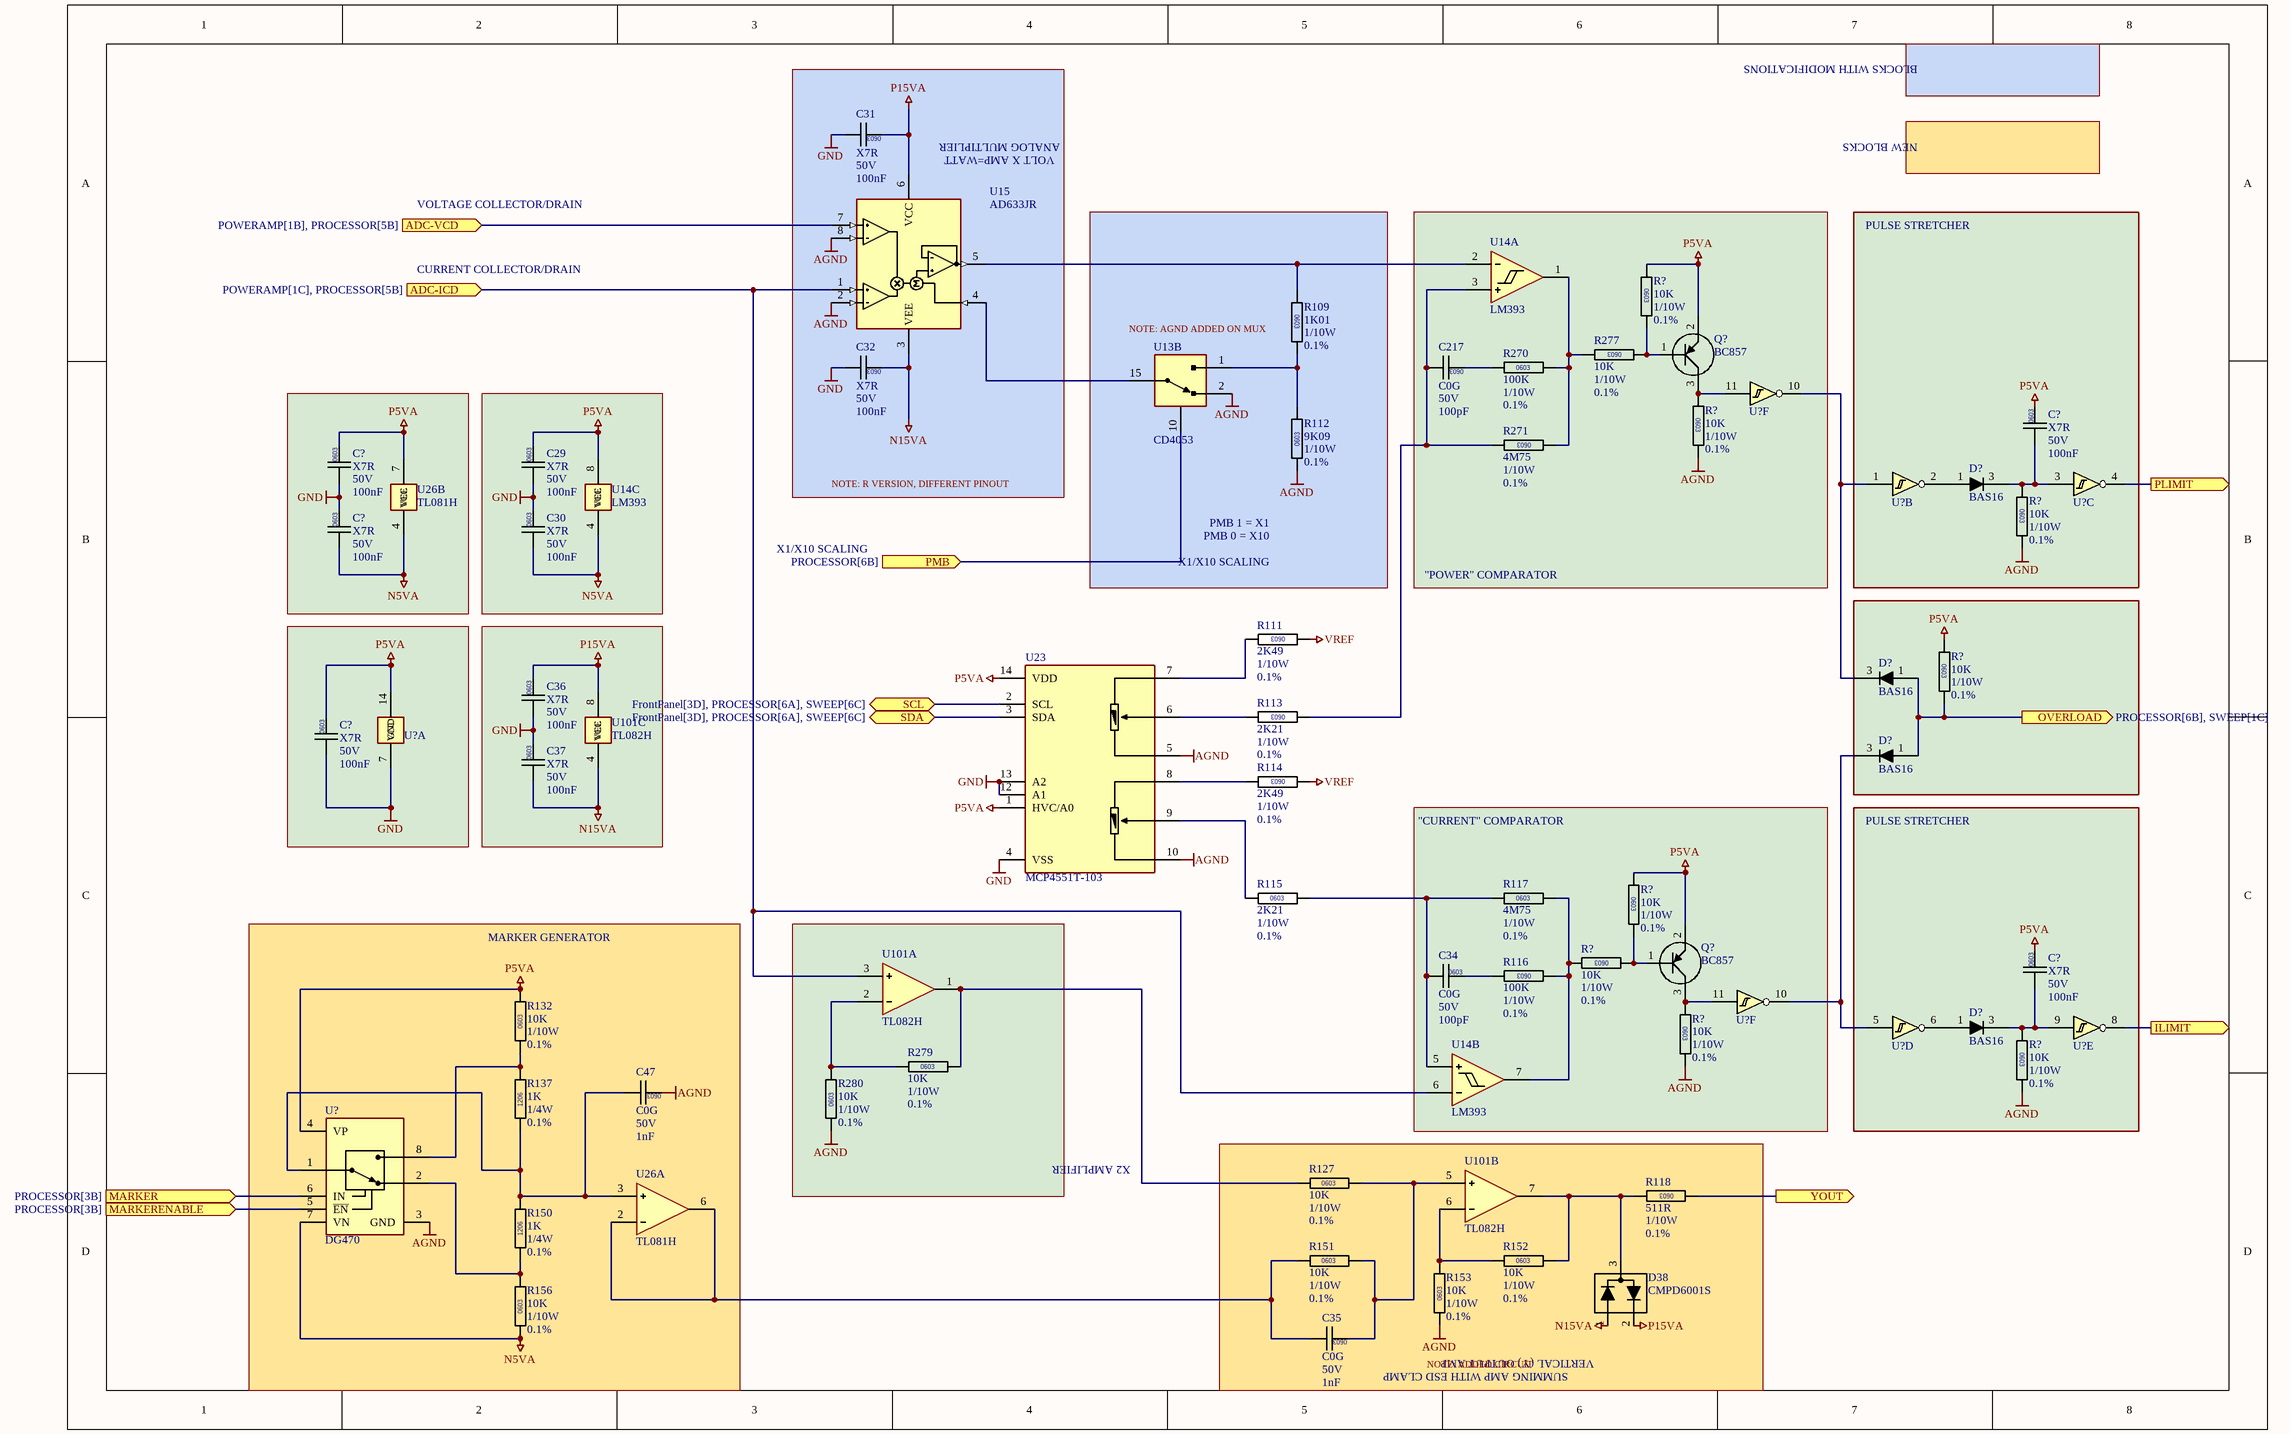
[diagram p8: MULTIPLIER.SchDoc]

### Parts
(Parts that share a designator on the sheet are numbered #1, #2 ... from top to bottom, then left to right.)
C29  Dielectric: X7R  Voltage: 50V  Capacitance: 100nF  [CAPC0603]  (hidden comment: CAP0603)
C30  Dielectric: X7R  Voltage: 50V  Capacitance: 100nF  [CAPC0603]  (hidden comment: CAP0603)
C31  Dielectric: X7R  Voltage: 50V  Capacitance: 100nF  [CAPC0603]  (hidden comment: CAP0603)
C32  Dielectric: X7R  Voltage: 50V  Capacitance: 100nF  [CAPC0603]  (hidden comment: CAP0603)
C34  Dielectric: C0G  Voltage: 50V  Capacitance: 100pF  [CAPC0603]  (hidden comment: CAP0603)
C35  Dielectric: C0G  Voltage: 50V  Capacitance: 1nF  [CAPC0603]  (hidden comment: CAP0603)
C36  Dielectric: X7R  Voltage: 50V  Capacitance: 100nF  [CAPC0603]  (hidden comment: CAP0603)
C37  Dielectric: X7R  Voltage: 50V  Capacitance: 100nF  [CAPC0603]  (hidden comment: CAP0603)
C47  Dielectric: C0G  Voltage: 50V  Capacitance: 1nF  [CAPC0603]  (hidden comment: CAP0603)
C217  Dielectric: C0G  Voltage: 50V  Capacitance: 100pF  [CAPC0603]  (hidden comment: CAP0603)
C?#2  Dielectric: X7R  Voltage: 50V  Capacitance: 100nF  [CAPC0603]  (hidden comment: CAP0603)
C?#3  Dielectric: X7R  Voltage: 50V  Capacitance: 100nF  [CAPC0603]  (hidden comment: CAP0603)
C?#4  Dielectric: X7R  Voltage: 50V  Capacitance: 100nF  [CAPC0603]  (hidden comment: CAP0603)
C?#5  Dielectric: X7R  Voltage: 50V  Capacitance: 100nF  [CAPC0603]  (hidden comment: CAP0603)
C?#6  Dielectric: X7R  Voltage: 50V  Capacitance: 100nF  [CAPC0603]  (hidden comment: CAP0603)
D38  CMPD6001S  [SOT23]
D?#2  BAS16  [SOT23]
D?#3  BAS16  [SOT23]
D?#4  BAS16  [SOT23]
D?#5  BAS16  [SOT23]
Q?#1  BC857  [SOT23]
Q?#2  BC857  [SOT23]
R109  value 1K01  Power: 1/10W  Tolerance: 0.1%  [RESC0603]  (hidden comment: RESC0603)
R111  value 2K49  Power: 1/10W  Tolerance: 0.1%  [RESC0603]  (hidden comment: RESC0603)
R112  value 9K09  Power: 1/10W  Tolerance: 0.1%  [RESC0603]  (hidden comment: RESC0603)
R113  value 2K21  Power: 1/10W  Tolerance: 0.1%  [RESC0603]  (hidden comment: RESC0603)
R114  value 2K49  Power: 1/10W  Tolerance: 0.1%  [RESC0603]  (hidden comment: RESC0603)
R115  value 2K21  Power: 1/10W  Tolerance: 0.1%  [RESC0603]  (hidden comment: RESC0603)
R116  value 100K  Power: 1/10W  Tolerance: 0.1%  [RESC0603]  (hidden comment: RESC0603)
R117  value 4M75  Power: 1/10W  Tolerance: 0.1%  [RESC0603]  (hidden comment: RESC0603)
R118  value 511R  Power: 1/10W  Tolerance: 0.1%  [RESC0603]  (hidden comment: RESC0603)
R127  value 10K  Power: 1/10W  Tolerance: 0.1%  [RESC0603]  (hidden comment: RESC0603)
R132#1  value 10K  Power: 1/10W  Tolerance: 0.1%  [RESC0603]  (hidden comment: RESC0603)
R137#1  value 1K  Power: 1/4W  Tolerance: 0.1%  [RESC1206]  (hidden comment: RESC1206)
R150  value 1K  Power: 1/4W  Tolerance: 0.1%  [RESC1206]  (hidden comment: RESC1206)
R151  value 10K  Power: 1/10W  Tolerance: 0.1%  [RESC0603]  (hidden comment: RESC0603)
R152  value 10K  Power: 1/10W  Tolerance: 0.1%  [RESC0603]  (hidden comment: RESC0603)
R153  value 10K  Power: 1/10W  Tolerance: 0.1%  [RESC0603]  (hidden comment: RESC0603)
R156  value 10K  Power: 1/10W  Tolerance: 0.1%  [RESC0603]  (hidden comment: RESC0603)
R270  value 100K  Power: 1/10W  Tolerance: 0.1%  [RESC0603]  (hidden comment: RESC0603)
R271  value 4M75  Power: 1/10W  Tolerance: 0.1%  [RESC0603]  (hidden comment: RESC0603)
R277  value 10K  Power: 1/10W  Tolerance: 0.1%  [RESC0603]  (hidden comment: RESC0603)
R279  value 10K  Power: 1/10W  Tolerance: 0.1%  [RESC0603]  (hidden comment: RESC0603)
R280  value 10K  Power: 1/10W  Tolerance: 0.1%  [RESC0603]  (hidden comment: RESC0603)
R?#5  value 10K  Power: 1/10W  Tolerance: 0.1%  [RESC0603]  (hidden comment: RESC0603)
R?#6  value 10K  Power: 1/10W  Tolerance: 0.1%  [RESC0603]  (hidden comment: RESC0603)
R?#7  value 10K  Power: 1/10W  Tolerance: 0.1%  [RESC0603]  (hidden comment: RESC0603)
R?#8  value 10K  Power: 1/10W  Tolerance: 0.1%  [RESC0603]  (hidden comment: RESC0603)
R?#9  value 10K  Power: 1/10W  Tolerance: 0.1%  [RESC0603]  (hidden comment: RESC0603)
R?#10  value 10K  Power: 1/10W  Tolerance: 0.1%  [RESC0603]  (hidden comment: RESC0603)
R?#11  value 10K  Power: 1/10W  Tolerance: 0.1%  [RESC0603]  (hidden comment: RESC0603)
R?#12  value 10K  Power: 1/10W  Tolerance: 0.1%  [RESC0603]  (hidden comment: RESC0603)
U13  CD4053  [SO127P600-16N]  (part B of 4)
U14  LM393  [SO127P600-8N]  (parts A,B,C of 3)
U15  AD633JR  [SO127P600-8N]
U23  MCP4551T-103
U26  TL081H  [SO127P600-8N]  (parts A,B of 2)
U101  TL082H  [SO127P600-8N]  (parts A,B,C of 3)
U?#10  CD40106  (value not drawn)  (part F of 7)
U?#11  CD40106  (value not drawn)  (part B of 7)
U?#12  CD40106  (value not drawn)  (part C of 7)
U?#13  CD40106  (value not drawn)  (part A of 7)
U?#14  CD40106  (value not drawn)  (part F of 7)
U?#15  CD40106  (value not drawn)  (part D of 7)
U?#16  CD40106  (value not drawn)  (part E of 7)
U?#17  DG470  [SO127P600-8N]

### Blocks framed on the sheet
"POWER" COMPARATOR: C217 Q?#1 R270 R271 R277 R?#5 R?#6 U14 U?#10
PULSE STRETCHER: C?#2 D?#2 R?#7 U?#11 U?#12
"CURRENT" COMPARATOR: C34 Q?#2 R116 R117 R?#9-R?#11 U14 U?#14
PULSE STRETCHER: C?#6 D?#5 R?#12 U?#15 U?#16
MARKER GENERATOR: C47 R132#1 R137#1 R150 R156 U26 U?#17
X2 AMPLIFIER: R279 R280 U101

### Ports
ADC-ICD (in, see POWERAMP[1C], PROCESSOR[5B]), ADC-VCD (in, see POWERAMP[1B], PROCESSOR[5B]), ILIMIT (out), MARKER (in, see PROCESSOR[3B]), MARKERENABLE (in, see PROCESSOR[3B]), OVERLOAD (out, see PROCESSOR[6B], SWEEP[1C]), PLIMIT (out), PMB (in, see PROCESSOR[6B]), SCL (bidir, see FrontPanel[3D], PROCESSOR[6A], SWEEP[6C]), SDA (bidir, see FrontPanel[3D], PROCESSOR[6A], SWEEP[6C]), YOUT (out)

### Nets
AGND: C47.1 R112.2 R153.2 R280.2 R?#6.1 R?#7.1 R?#11.1 R?#12.1 U13.2(Y2) U15.2(YN) U15.8(X1N) U23.5(POA) U23.10(POB) U?#17.3(GND)
GND: C29.2 C30.1 C31.2 C32.2 C36.2 C37.1 C?#3.2 C?#4.1 C?#5.2 U23.4(VSS) U23.12(A1) U23.13(A2) U?#13.7(GND)
N5VA: C30.2 C?#4.2 R156.2 U14.4(VEE) U26.4(VEE) U?#17.7(VN)
N15VA: C32.1 C37.2 D38.1(K) U15.3(VEE) U101.4(VEE)
P5VA: C29.1 C?#2.1 C?#3.1 C?#5.1 C?#6.1 Q?#1.2(E) Q?#2.2(E) R132#1.1 R?#5.2 R?#8.2 R?#9.2 U14.8(VCC) U23.1(HVC/A0) U23.14(VDD) U26.7(VCC) U?#13.14(VCC) U?#17.4(VP)
P15VA: C31.1 C36.1 D38.2(A) U15.6(VCC) U101.8(VCC)
VREF: R111.2 R114.2
ADC-ICD: U14.6(-) U15.1(YP) U101.3(+) ; port ADC-ICD
ADC-VCD: U15.7(X1P) ; port ADC-VCD
ILIMIT: U?#16.8 ; port ILIMIT
MARKER: U?#17.6(IN) ; port MARKER
MARKERENABLE: U?#17.5(~{EN}) ; port MARKERENABLE
OVERLOAD: D?#3.1(A) D?#4.1(A) R?#8.1 ; port OVERLOAD
PLIMIT: U?#12.4 ; port PLIMIT
PMB: U13.10(A) ; port PMB
SCL: U23.2(SCL) ; port SCL
SDA: U23.3(SDA) ; port SDA
YOUT: R118.2 ; port YOUT
NetC34_1: C34.1 R116.2
NetC34_2: C34.2 R115.1 R117.2 U14.5(+)
NetC35_1: C35.1 R127.1 R151.1 U101.5(+)
NetC35_2: C35.2 R151.2 U26.2(-) U26.6(O)
NetC47_2: C47.2 R137#1.2 R150.1 U26.3(+) U?#17.1(COM)
NetC217_1: C217.1 R270.2
NetC217_2: C217.2 R113.2 R271.2 U14.3(+)
NetC?#2_2: C?#2.2 D?#2.3(K) R?#7.2 U?#12.3
NetC?#6_2: C?#6.2 D?#5.3(K) R?#12.2 U?#16.9
NetD38_3: D38.3(A) R118.1 R152.1 U101.7(O)
NetD?#2_1: D?#2.1(A) U?#11.2
NetD?#3_3: D?#3.3(K) U?#10.10 U?#11.1
NetD?#4_3: D?#4.3(K) U?#14.10 U?#15.5
NetD?#5_1: D?#5.1(A) U?#15.6
NetQ?#1_1: Q?#1.1(B) R277.2 R?#5.1
NetQ?#1_3: Q?#1.3(C) R?#6.2 U?#10.11
NetQ?#2_1: Q?#2.1(B) R?#9.1 R?#10.2
NetQ?#2_3: Q?#2.3(C) R?#11.2 U?#14.11
NetR109_1: R109.1 R112.1 U13.1(Y0)
NetR109_2: R109.2 U14.2(-) U15.5(W)
NetR111_1: R111.1 U23.7(POB)
NetR113_1: R113.1 U23.6(OW)
NetR114_1: R114.1 U23.8(POA)
NetR115_2: R115.2 U23.9(OW)
NetR116_1: R116.1 R117.1 R?#10.1 U14.7(O)
NetR127_2: R127.2 R279.1 U101.1(O)
NetR132#1_2: R132#1.2 R137#1.1 U?#17.8(NO)
NetR150_2: R150.2 R156.1 U?#17.2(COM)
NetR152_2: R152.2 R153.1 U101.6(-)
NetR270_1: R270.1 R271.1 R277.1 U14.1(O)
NetR279_2: R279.2 R280.1 U101.2(-)
NetU13_15: U13.15(X2) U15.4(Z)

### Notes on the sheet
- BLOCKS WITH MODIFICATIONS
- (near U15) ANALOG MULTIPLIER
- (near U15) VOLT X AMP=WATT
- NEW BLOCKS
- VOLTAGE COLLECTOR/DRAIN
- CURRENT COLLECTOR/DRAIN
- (near U13) NOTE: AGND ADDED ON MUX
- NOTE: R VERSION, DIFFERENT PINOUT
- X1/X10 SCALING
- PMB 0 = X10
- PMB 1 = X1
- (near R153) NOTE: ADDED CIRCUIT
- SUMMING AMP WITH ESD CLAMP
- (near D38) VERTICAL (Y) OUTPUT AMP
- (in symbol RESC-0603-1K01-0.1%-1/10W) 0603
- (in symbol RESC-0603-2K21-0.1%-1/10W) 0603
- (in symbol RESC-0603-2K49-0.1%-1/10W) 0603
- (in symbol RESC-0603-4M75-1%-1/10W) 0603
- (in symbol RESC-0603-9K09-0.1%-1/10W) 0603
- (in symbol RESC-0603-10K-0.1%-1/10W) 0603
- (in symbol RESC-0603-100K-0.1%-1/10W) 0603
- (in symbol RESC-0603-511R-0.1%) 0603
- (in symbol RESC-1206-1K-0.1%-1/4W) 1206

### Library data of the parts
C29-C32 C36 C37 C?#2-C?#6 = CAPC-0603-100nF-50V-X7R: as C10-C20 on sheet IBVG-DRIVER; Package / Case: 0603; Location: *; Supplier 1: Mouser; Supplier Part Number 1: 80-C0603C104K5R7867; Supplier 2: Mouser; Supplier Part Number 2: 80-C0603C104K5R7411; Supplier 3: Avnet; Supplier Part Number 3: KGM15BR71H104KT; Supplier 4: Digikey; Supplier Part Number 4: 1276-1000-1-ND; LCSC: C127833; MOUSER: 80-C0603C104K5R
C34 C217 = CAPC-0603-100pF-50V-C0G: CAPACITOR,CERAMIC,100pF,50V,C0G,0603; Package / Case: 0603; Location: *
C35 C47 = CAPC-0603-1nF-20V-C0G: CAPACITOR,CERAMIC,1nF,50V,C0G,0603; Package / Case: 0603; Location: *
D38 = DIODE-CENTRALSEMI-CMPD6001S: as D23 on sheet IBVG-DRIVER; Manufacturer Part Number 1: CMPD6001S
D?#2-D?#5 = DIODE-RECTIFIER-DIODES-BAS16-SOT23: as D31-D33 on sheet IBVG-DRIVER; DIGIKEY: BAS16LT1GOSCT-ND
Q?#1 Q?#2 = XSTR-PNP-BC857: as Q3 on sheet IBVG-DRIVER; DIGIKEY: 1727-4869-1-ND
R109 = RESC-0603-1K01-0.1%-1/10W: RESISTOR,1K01,0.1%,100mW,0603 (1608); Location: *
R111 R114 = RESC-0603-2K49-0.1%-1/10W: RESISTOR,2K49,0.1%,100mW,0603 (1608); Location: *
R112 = RESC-0603-9K09-0.1%-1/10W: RESISTOR,9K09,0.1%,100mW,0603 (1608); Location: *
R113 R115 = RESC-0603-2K21-0.1%-1/10W: RESISTOR,2K21,0.1%,100mW,0603 (1608); Location: *
R116 R270 = RESC-0603-100K-0.1%-1/10W: RESISTOR,100K,0.1%,100mW,0603 (1608); Location: *
R117 R271 = RESC-0603-4M75-1%-1/10W: RESISTOR,4M75,0.1%,100mW,0603 (1608); Location: *
R118 = RESC-0603-511R-0.1%: RESISTOR,511R,0.1%,100mW,0603 (1608); Location: *
R127 R132#1 R151-R153 R156 R277 R279 R280 R?#5-R?#12 = RESC-0603-10K-0.1%-1/10W: RESISTOR,10K,0.1%,100mW,0603 (1608); Location: *
R137#1 R150 = RESC-1206-1K-0.1%-1/4W: RESISTOR,1K,1206,0.1%,125mW,1206; Location: *; Parameter 4: *
U13 = IC-TI-CD4053-SPLIT: as U206 on sheet IBVG-DRIVER
U14 = IC-TI-LM393-SO8: IC,COMPARATOR,DUAL,LM393,SO8; Manufacturer 1: DIODES-INC; Manufacturer Part Number 1: AS393AMTR-E1; DIGIKEY: AS393AMTR-E1
U15 = IC-ANALOG-AD633XR-SO8: IC,ANALOG,MULTIPLIER,ANALOGDEVICES,AD633JRZ,SO8; DIGIKEY: 505-AD633JRZ-ND; Manufacturer 1: ANALOG DEVICES; Manufacturer Part Number 1: AD633JRZ
U23 = IC-MICROCHIP-MCP4651T-103: IC,DIGITAL POTMETER,257STEP,I2C,10K,MICROCHIP,MCP4551T-103
U26 = IC-TI-TL081-SO8: IC,OPAMP JFET,SINGLE,TL081HIDR,SO8; Manufacturer 1: TI; Manufacturer Part Number 1: TL081HIDR; MOUSER: 595-TL081HIDR
U101 = IC-TI-TL082H-SO8: as U1000 on sheet SWEEP; Manufacturer Part Number 1: TL082HIDR; MOUSER: 595-TL082HIDR
U?#10-U?#16 = IC-TI-CD40106-SO14: IC,LOGIC,CMOS.4XXX,HEX SCHMITTTRIGGER,CD40106,SO14; Manufacturer 1: ONSEMI; Manufacturer Part Number 1: MC74AC14DR2G; DIGIKEY: MC74AC14DR2GOSCT-ND
U?#17 = IC-SILICONIX-DG470EY-T1-E3-SO8: IC,ANALOG,SPDT ANALOG SWITCH,SILICONIX,DG470EY-T1-E3,SO8; Manufacturer 1: VSHIAY; DIGIKEY: DG470EY-T1-E3CT-ND; Manufacturer Part Number 1: DG470EY-T1-E3

## Sheet PSU48.SchDoc
size A; SheetNumber: 10; SheetTotal: 10
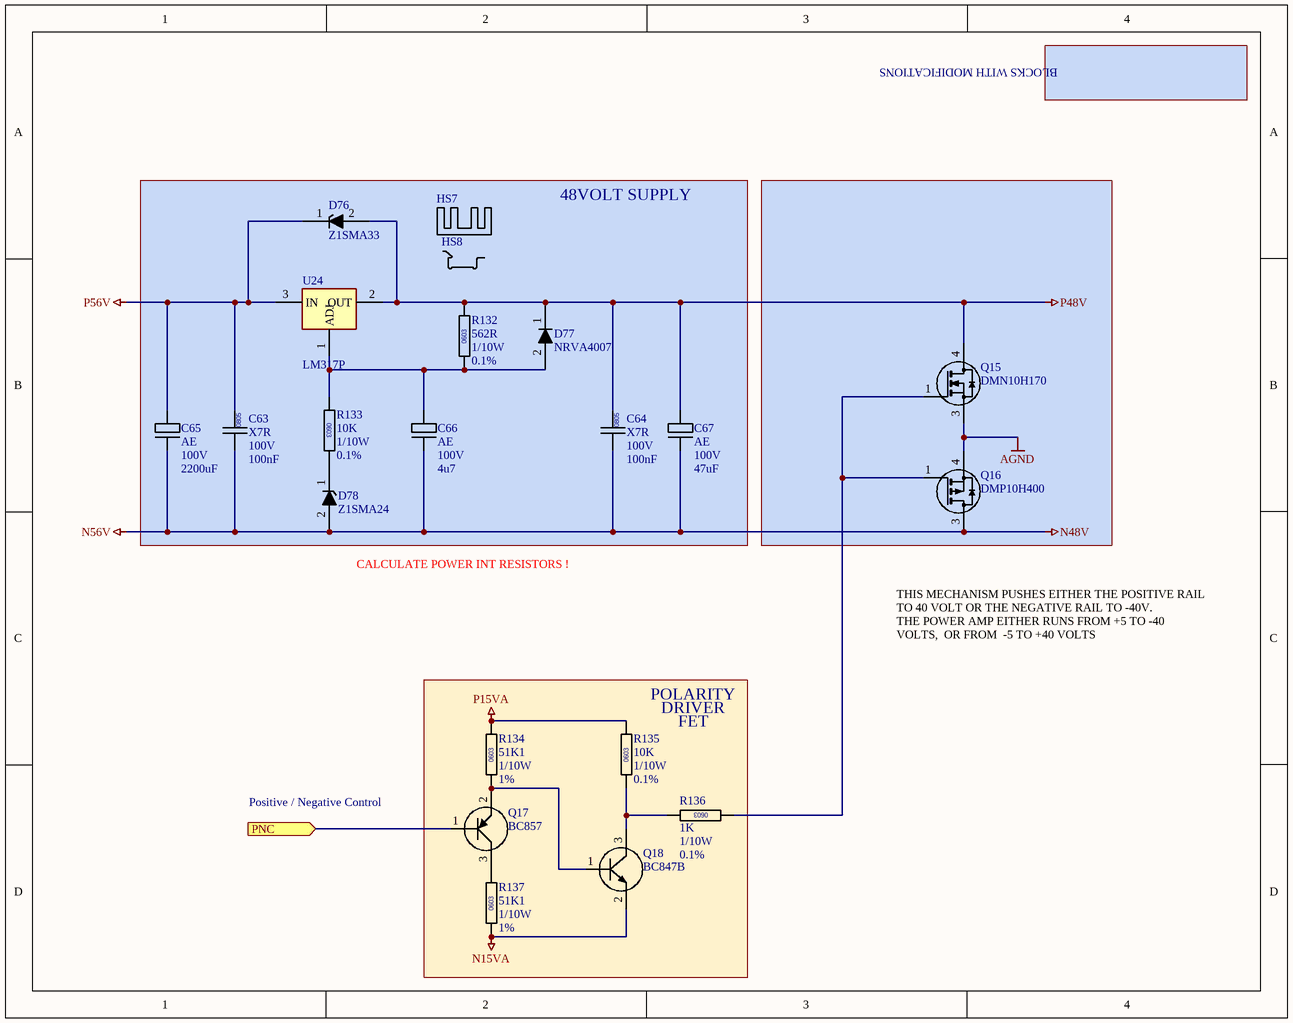
[diagram p9: PSU48.SchDoc]

### Parts
(Parts that share a designator on the sheet are numbered #1, #2 ... from top to bottom, then left to right.)
C63  Dielectric: X7R  Voltage: 100V  Capacitance: 100nF  [CAPC0805]  (hidden comment: CAP0805)
C64  Dielectric: X7R  Voltage: 100V  Capacitance: 100nF  [CAPC0805]  (hidden comment: CAP0805)
C65  Dielectric: AE  Voltage: 100V  Capacitance: 2200uF  [CAPAE-NICHICON-LGY2A222MELC30]  (hidden comment: CAP0603)
C66  Dielectric: AE  Voltage: 100V  Capacitance: 4u7  [CAPAE-PANASONIC-ECA-2AM4R7I]  (hidden comment: CAP0603)
C67  Dielectric: AE  Voltage: 100V  Capacitance: 47uF  [CAPAE-KEMET-ESL476M100AH9AA]  (hidden comment: CAP0603)
D76  Z1SMA33  [DO214AC]
D77  NRVA4007  [DO214AC]
D78  Z1SMA24  [DO214AC]
HS7  HEATSINK-CUI-HSS06-C20-P32  [HEATSINK-CUI-HSS06-C20-P32]  (value not drawn)
HS8  HEATSINK-CUI-HSC-05  [HEATSINK-CUI-HSS06-C20-P32]  (value not drawn)
Q15#2  DMN10H170  [DPAK]
Q16#2  DMP10H400  [DPAK]
Q17#2  BC857  [SOT23]
Q18#2  BC847B  [SOT23]
R132#2  value 562R  Power: 1/10W  Tolerance: 0.1%  [RESC0603]  (hidden comment: RESC0603)
R133#2  value 10K  Power: 1/10W  Tolerance: 0.1%  [RESC0603]  (hidden comment: RESC0603)
R134#2  value 51K1  Power: 1/10W  Tolerance: 1%  [RESC0603]  (hidden comment: RESC0603)
R135#2  value 10K  Power: 1/10W  Tolerance: 0.1%  [RESC0603]  (hidden comment: RESC0603)
R136#2  value 1K  Power: 1/10W  Tolerance: 0.1%  [RESC0603]  (hidden comment: RESC0603)
R137#2  value 51K1  Power: 1/10W  Tolerance: 1%  [RESC0603]  (hidden comment: RESC0603)
U24  LM317P  [TO220V-OVERMOLD]

### Blocks framed on the sheet
48VOLT SUPPLY: C63-C67 D76-D78 HS7 HS8 R132#2 R133#2 U24

### Ports
PNC (in)

### Nets
AGND: Q15#2.3(S) Q16#2.4(S)
N15VA: Q18#2.2(E) R137#2.2
N56V: C63.2 C64.2 C65.2 C66.2 C67.2 D78.2(A) Q16#2.3(D)  [also labelled N48V]
P15VA: R134#2.1 R135#2.1
P48V: C64.1 C67.1 D76.2(A) D77.1(K) Q15#2.4(D) R132#2.1 U24.2(OUT)
P56V: C63.1 C65.1 D76.1(K) U24.3(IN)
PNC: Q17#2.1(B) ; port PNC
NetC66_1: C66.1 D77.2(A) R132#2.2 R133#2.2 U24.1(ADJ)
NetD78_1: D78.1(K) R133#2.1
NetQ15#2_1: Q15#2.1(G1) Q16#2.1(G1) R136#2.2
NetQ17#2_2: Q17#2.2(E) Q18#2.1(B) R134#2.2
NetQ17#2_3: Q17#2.3(C) R137#2.1
NetQ18#2_3: Q18#2.3(C) R135#2.2 R136#2.1

### Notes on the sheet
- BLOCKS WITH MODIFICATIONS
- CALCULATE POWER INT RESISTORS !
- (near R135#2) POLARITY
- (near R135#2) DRIVER
- FET
- THIS MECHANISM PUSHES EITHER THE POSITIVE RAIL TO 40 VOLT OR THE NEGATIVE RAIL TO -40V.
  THE POWER AMP EITHER RUNS FROM +5 TO -40 VOLTS,  OR FROM  -5 TO +40 VOLTS
- Positive / Negative Control
- (in symbol CAPC-0805-100nF-100V) 0805
- (in symbol RESC-0603-1K-0.1%-1/10W) 0603
- (in symbol RESC-0603-10K-0.1%-1/10W) 0603
- (in symbol RESC-0603-51K1-1%-1/10W) 0603
- (in symbol RESC-0603-562R-0.1%-1/10W) 0603

### Library data of the parts
C63 C64 = CAPC-0805-100nF-100V: CAPACITOR,CERAMIC,100nF,100V,X7R,0805; Package / Case: 0805 (2012 metric); Location: *
C65 = CAPP-AE-2200uF-100V-TH100P350D320H: CAPACITOR,ALU,2200uF,100V,TH,P10mm,D35mm,H32mm,SNAP; Manufacturer 1: NICHICON; Manufacturer Part Number 1: LGY2A222MELC30; Location: *
C66 = CAPP-AE-4u7-100V-TH025P050D120H: CAPACITOR,ALU,4u7,100V,TH,P0.25mm,D50mm,H12mm; Manufacturer 1: PANASONIC; Manufacturer Part Number 1: ECA-2AM4R7I; Location: *
C67 = CAPP-AE-47uF-100V-TH050P100D140H: CAPACITOR,ALU,47uF,100V,TH,P5mm,D10mm,H14mm; Manufacturer 1: KEMET; Manufacturer Part Number 1: ESL476M100AH9AA; Location: *; DIGIKEY: 399-15746-ND
D76 = ZENER-DIOTEC-Z1SMA33: DIODE,ZENER,33V,1W,Z1SMA33,DO214AC(SMA); Manufacturer 1: DIOTEC; Manufacturer Part Number 1: Z1SMA24
D77 = DIODE-ONSEMI-NRVA4007T3G: DIODE,RECTIFIER,1000V,1A,ONSEMI,NRVA4007,SMA; DIGIKEY: NRVA4007T3GOSCT-ND; Manufacturer 1: ONSEMI; Manufacturer Part Number 1: NRVA4007T3G
D78 = ZENER-DIOTEC-Z1SMA24: DIODE,ZENER,24V,1W,Z1SMA24,DO214AC(SMA); Manufacturer 1: DIOTEC; Manufacturer Part Number 1: Z1SMA24
HS7 = HEATSINK-CUI-HSS06-C20-P32: HEATSINKSTAMPED,CLIP-ON,BOARDMOUNT,3W,25C/W,CUI,HSS06-C20-P32
HS8 = HEATSINK-CUI-HSC-05: HEATSINK,CLIP FOR HSS01-B20-CP; Manufacturer 1: CUI; DIGIKEY: HSS01-B20-CP; Manufacturer Part Number 1: HSS01-B20-CP
Q15#2 = XSTR-NMOS-DIODES-DMN10H170SK3-13: XSTR,NMOS,100V,12A,DMN10H170SK3-13,DPAK; Manufacturer 1: DIODES; Idmax: 5.6; Package: DPAK; Vds: 100V; Manufacturer Part Number 1: DMN10H170SK3-13
Q16#2 = XSTR-PMOS-DIODES-DMP10H400SK3-13: XSTR,PMOS,100V,5.6A,DMP10H400SK3-13,DPAK; Manufacturer 1: DIODES; Idmax: 9A; Package: DPAK; Vds: 100V; Manufacturer Part Number 1: DMP10H400SK3-13
Q17#2 = XSTR-PNP-BC857: XSTR,PNP,SOT23,BC857,SOT23
Q18#2 = XSTR-NPN-BC847: XSTR,NPN,45V,0.1A,,BC847B,SOT23
R132#2 = RESC-0603-562R-0.1%-1/10W: RESISTOR,562R,0.1%,100mW,0603 (1608); Location: *
R133#2 R135#2 = RESC-0603-10K-0.1%-1/10W: RESISTOR,10K,0.1%,100mW,0603 (1608); Location: *
R134#2 R137#2 = RESC-0603-51K1-1%-1/10W: RESISTOR,51K1,1%,100mW,0603 (1608); Location: *
R136#2 = RESC-0603-1K-0.1%-1/10W: RESISTOR,1K,0.1%,100mW,0603 (1608); Location: *
U24 = IC-ST-LM317P-TO220FP: IC,VOLTAGE REG,LIN,POSITIVE,ADJ,LM317P,TO220

## Sheet POWERMUX.SchDoc
size Tabloid; SheetNumber: 8; SheetTotal: 9
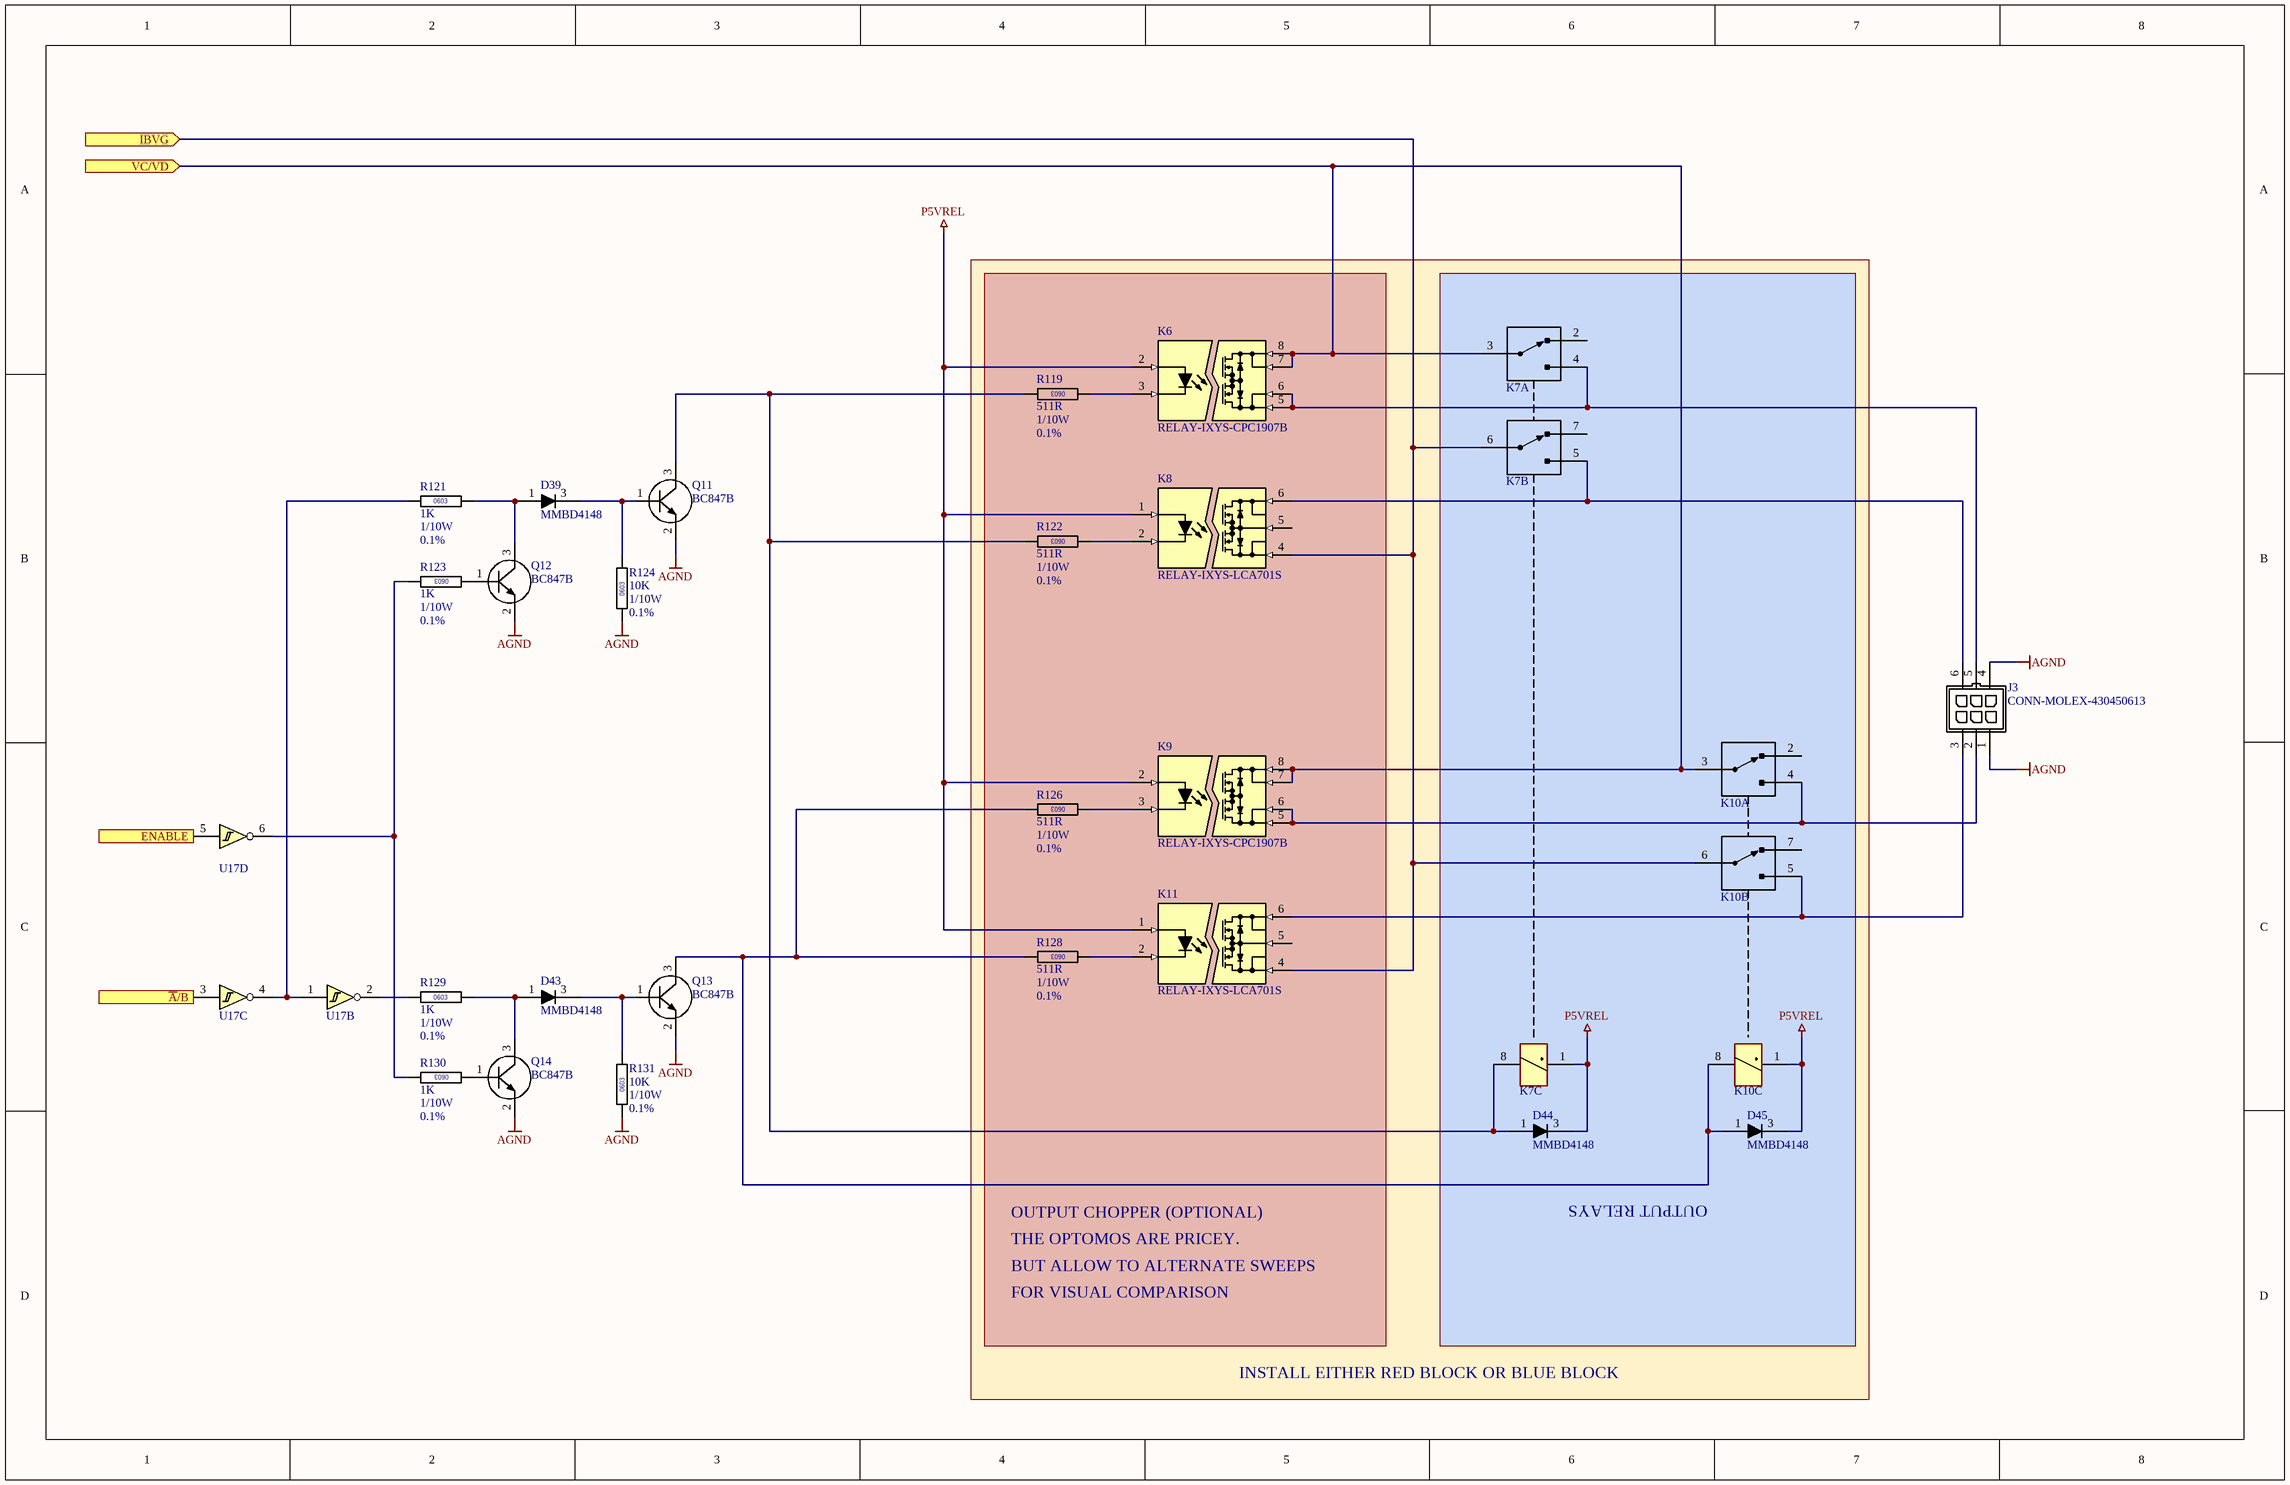
[diagram p10: POWERMUX.SchDoc]

### Parts
D39  MMBD4148
D43  MMBD4148
D44  MMBD4148
D45  MMBD4148
J3  CONN-MOLEX-430450613  [CONN-MOLEX-430450613]
K6  RELAY-IXYS-CPC1907B  [SO508P1676-8N]
K7  RELAY-KEMET-UA2-5NJ  [RELAY-KEMET-UA2-5NJ]  (value not drawn)  (parts A,B,C of 3)
K8  RELAY-IXYS-LCA701S  [SO254P960-6N]
K9  RELAY-IXYS-CPC1907B  [SO508P1676-8N]
K10  RELAY-KEMET-UA2-5NJ  [RELAY-KEMET-UA2-5NJ]  (value not drawn)  (parts A,B,C of 3)
K11  RELAY-IXYS-LCA701S  [SO254P960-6N]
Q11  BC847B  [SOT23]
Q12  BC847B  [SOT23]
Q13  BC847B  [SOT23]
Q14  BC847B  [SOT23]
R119  value 511R  Power: 1/10W  Tolerance: 0.1%  [RESC0603]  (hidden comment: RESC0603)
R121  value 1K  Power: 1/10W  Tolerance: 0.1%  [RESC0603]  (hidden comment: RESC0603)
R122  value 511R  Power: 1/10W  Tolerance: 0.1%  [RESC0603]  (hidden comment: RESC0603)
R123  value 1K  Power: 1/10W  Tolerance: 0.1%  [RESC0603]  (hidden comment: RESC0603)
R124  value 10K  Power: 1/10W  Tolerance: 0.1%  [RESC0603]  (hidden comment: RESC0603)
R126  value 511R  Power: 1/10W  Tolerance: 0.1%  [RESC0603]  (hidden comment: RESC0603)
R128  value 511R  Power: 1/10W  Tolerance: 0.1%  [RESC0603]  (hidden comment: RESC0603)
R129  value 1K  Power: 1/10W  Tolerance: 0.1%  [RESC0603]  (hidden comment: RESC0603)
R130  value 1K  Power: 1/10W  Tolerance: 0.1%  [RESC0603]  (hidden comment: RESC0603)
R131  value 10K  Power: 1/10W  Tolerance: 0.1%  [RESC0603]  (hidden comment: RESC0603)
U17  IC-TI-74HC14  [SOT23-6]  (value not drawn)  (parts B,C,D of 7)

### Blocks framed on the sheet
OUTPUT RELAYS: D44 D45 K7 K10

### Ports
ENABLE (in), IBVG (in), VC/VD (in), ~{A}/B (in)

### Nets
AGND: J3.1 J3.4 Q11.2(E) Q12.2(E) Q13.2(E) Q14.2(E) R124.2 R131.2
P5VREL: D44.3(K) D45.3(K) K6.2 K7.1 K8.1 K9.2 K10.1 K11.1
~{A}/B: U17.3 ; port ~{A}/B
ENABLE: U17.5 ; port ENABLE
IBVG: K7.6(COM) K8.4 K10.6(COM) K11.4 ; port IBVG
VC/VD: K6.7 K6.8 K7.3(COM) K9.7 K9.8 K10.3(COM) ; port VC/VD
NetD39_1: D39.1(A) Q12.3(C) R121.1
NetD39_3: D39.3(K) Q11.1(B) R124.1
NetD43_1: D43.1(A) Q14.3(C) R129.1
NetD43_3: D43.3(K) Q13.1(B) R131.1
NetD44_1: D44.1(A) K7.8 Q11.3(C) R119.1 R122.1
NetD45_1: D45.1(A) K10.8 Q13.3(C) R126.1 R128.1
NetJ3_2: J3.2 K9.5 K9.6 K10.4(NO)
NetJ3_3: J3.3 K10.5(NO) K11.6
NetJ3_5: J3.5 K6.5 K6.6 K7.4(NO)
NetJ3_6: J3.6 K7.5(NO) K8.6
NetK6_3: K6.3 R119.2
NetK8_2: K8.2 R122.2
NetK9_3: K9.3 R126.2
NetK11_2: K11.2 R128.2
NetQ12_1: Q12.1(B) R123.2
NetQ14_1: Q14.1(B) R130.2
NetR121_2: R121.2 U17.1 U17.4
NetR123_1: R123.1 R130.1 U17.6
NetR129_2: R129.2 U17.2

Not connected (* = marked no-connect by the designer): K7 2(NC) 7(NC); K8 5; K10 2(NC) 7(NC); K11 5

### Notes on the sheet
- OUTPUT CHOPPER (OPTIONAL)
- THE OPTOMOS ARE PRICEY.
- BUT ALLOW TO ALTERNATE SWEEPS
- FOR VISUAL COMPARISON
- INSTALL EITHER RED BLOCK OR BLUE BLOCK
- (in symbol RESC-0603-1K-0.1%-1/10W) 0603
- (in symbol RESC-0603-10K-0.1%-1/10W) 0603
- (in symbol RESC-0603-511R-0.1%-1/10W) 0603

### Library data of the parts
D39 D43-D45 = DIODE-RECTIFIER-DIODES-MMBD4148-SOT23: as D24 on sheet IBVG-DRIVER; Manufacturer Part Number 1: MMBD4148
J3 = CONN-MOLEX-430450613: CONN,2X3,MOLEX MICROFIT,TH,VERT
K6 K9 = RELAY-IXYS-CPC1907B: RELAY,OPTOMOS,6A,60V,AC,IXYS,CPC1907B,SMD
K7 K10 = RELAY-KEMET-UA2-5NJ: as K3-K5 on sheet IBVG-DRIVER; DIGIKEY: 399-UA2-5NJ-ND; Manufacturer 1: KEMET; Manufacturer Part Number 1: UA2-5NJ
K8 K11 = RELAY-IXYS-LCA701S: RELAY,OPTOMOS,1.5A,100V,AC,IXYS,LCA701S,SMD
Q11-Q14 = XSTR-NPN-BC847: XSTR,NPN,45V,0.1A,,BC847B,SOT23
R119 R122 R126 R128 = RESC-0603-511R-0.1%-1/10W: RESISTOR,511R,0.1%,100mW,0603 (1608); Location: *
R121 R123 R129 R130 = RESC-0603-1K-0.1%-1/10W: RESISTOR,1K,0.1%,100mW,0603 (1608); Location: *
R124 R131 = RESC-0603-10K-0.1%-1/10W: RESISTOR,10K,0.1%,100mW,0603 (1608); Location: *
U17 = IC-TI-74HC14-SO14: IC,NOT,HEX,SCHMITTTRIGGER,ONSEMI,MC74AC14DR2G,SO14; DIGIKEY: MC74AC14DR2GOSCT-ND; Manufacturer 1: ONSEMI; Manufacturer Part Number 1: MC74AC14DR2G

## Nets that join several sheets
AGND: PSU (20 pins), POWERAMP (11 pins), IBVG-DRIVER (11 pins), SWEEP (28 pins), MULTIPLIER (14 pins), PSU48 (Q15#2.3 Q16#2.4), POWERMUX (8 pins)
GND: FrontPanel (J2.19 J2.20), PROCESSOR (15 pins), POWERAMP (Q9.2 Q10.2 U11.1 U30.5), IBVG-DRIVER (26 pins), MULTIPLIER (13 pins)
N5VA: PROCESSOR (U?#2.4), PSU (C52.2 D63.2 D67.1 U19.11), POWERAMP (12 pins), IBVG-DRIVER (7 pins), SWEEP (C75.1 C80.2 U12.4 U1000.4), MULTIPLIER (6 pins)
N15VA: PSU (6 pins), IBVG-DRIVER (13 pins), SWEEP (C76.2 D22.1 U1001.4), MULTIPLIER (5 pins), PSU48 (Q18#2.2 R137#2.2)
N56V: PSU (8 pins), POWERAMP (D35.1), PSU48 (7 pins)
P5VA: PROCESSOR (U?#2.11), PSU (5 pins), POWERAMP (11 pins), IBVG-DRIVER (7 pins), SWEEP (14 pins), MULTIPLIER (17 pins)
P5VD: FrontPanel (J2.1 J2.2), PROCESSOR (9 pins), PSU (Q16#1.3)
P5VREL: PSU (7 pins), POWERAMP (D36.3 D37.3 K1.1 K2.1), IBVG-DRIVER (6 pins), POWERMUX (8 pins)
P15VA: PSU (5 pins), IBVG-DRIVER (16 pins), SWEEP (C74.1 D22.2 U1001.8), MULTIPLIER (5 pins), PSU48 (R134#2.1 R135#2.1)
P48V: PSU (8 pins), POWERAMP (D231.2), PSU48 (7 pins)
VREF: IBVG-DRIVER (R38.1), SWEEP (5 pins), MULTIPLIER (R111.2 R114.2)
DRIVE: POWERAMP (U30.2), SWEEP (U16.6)